# EAGLE design open_bioband_VA.3final (EAGLE 8.0.0)
COMPANY: ADAFRUIT INDUSTRIES; DRAWN: KTOWN; REV: B
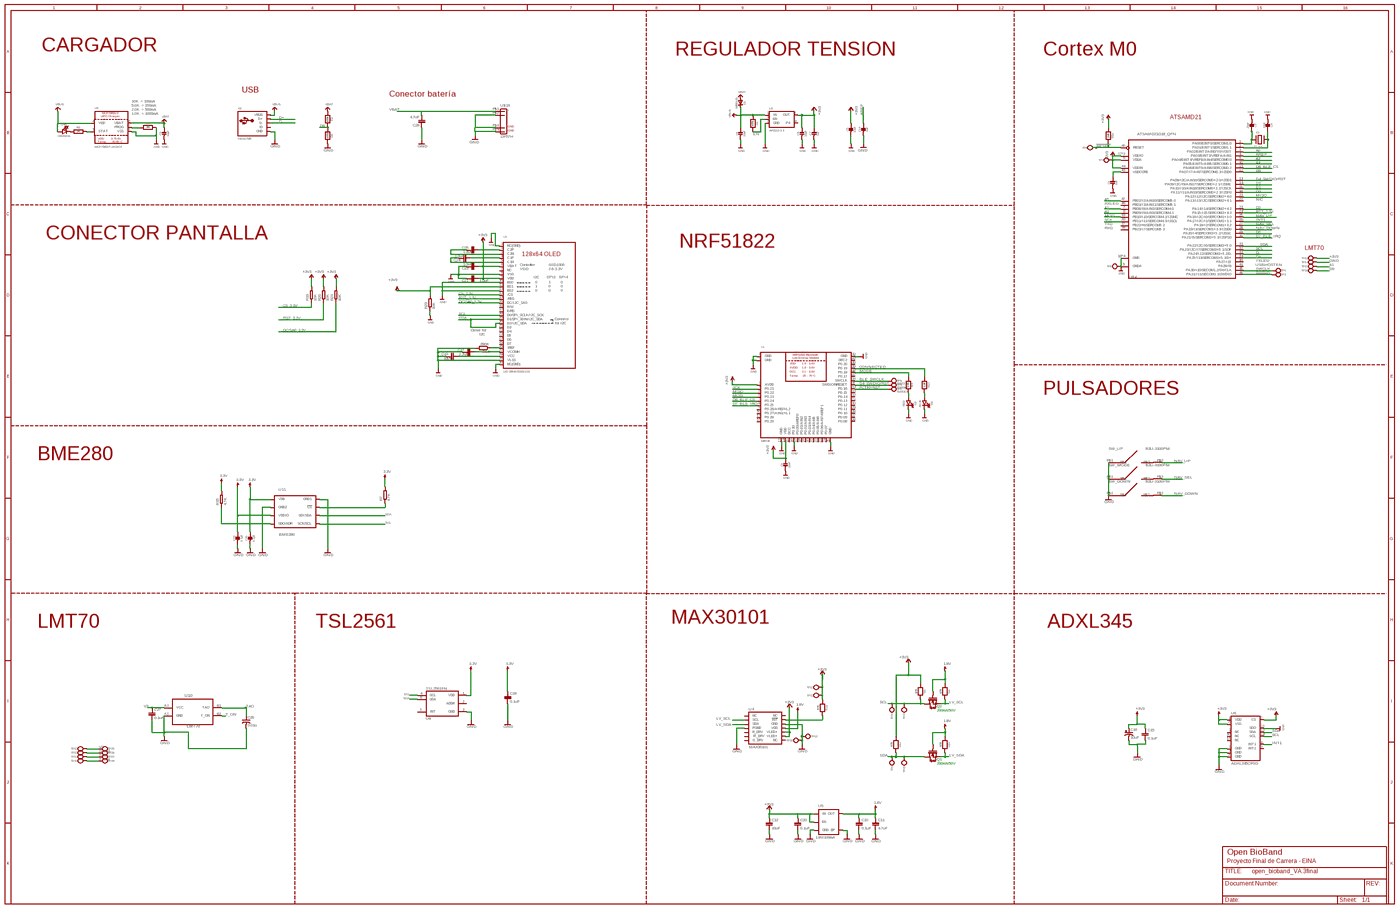
[diagram p0: schematic, sheet 1, overview]
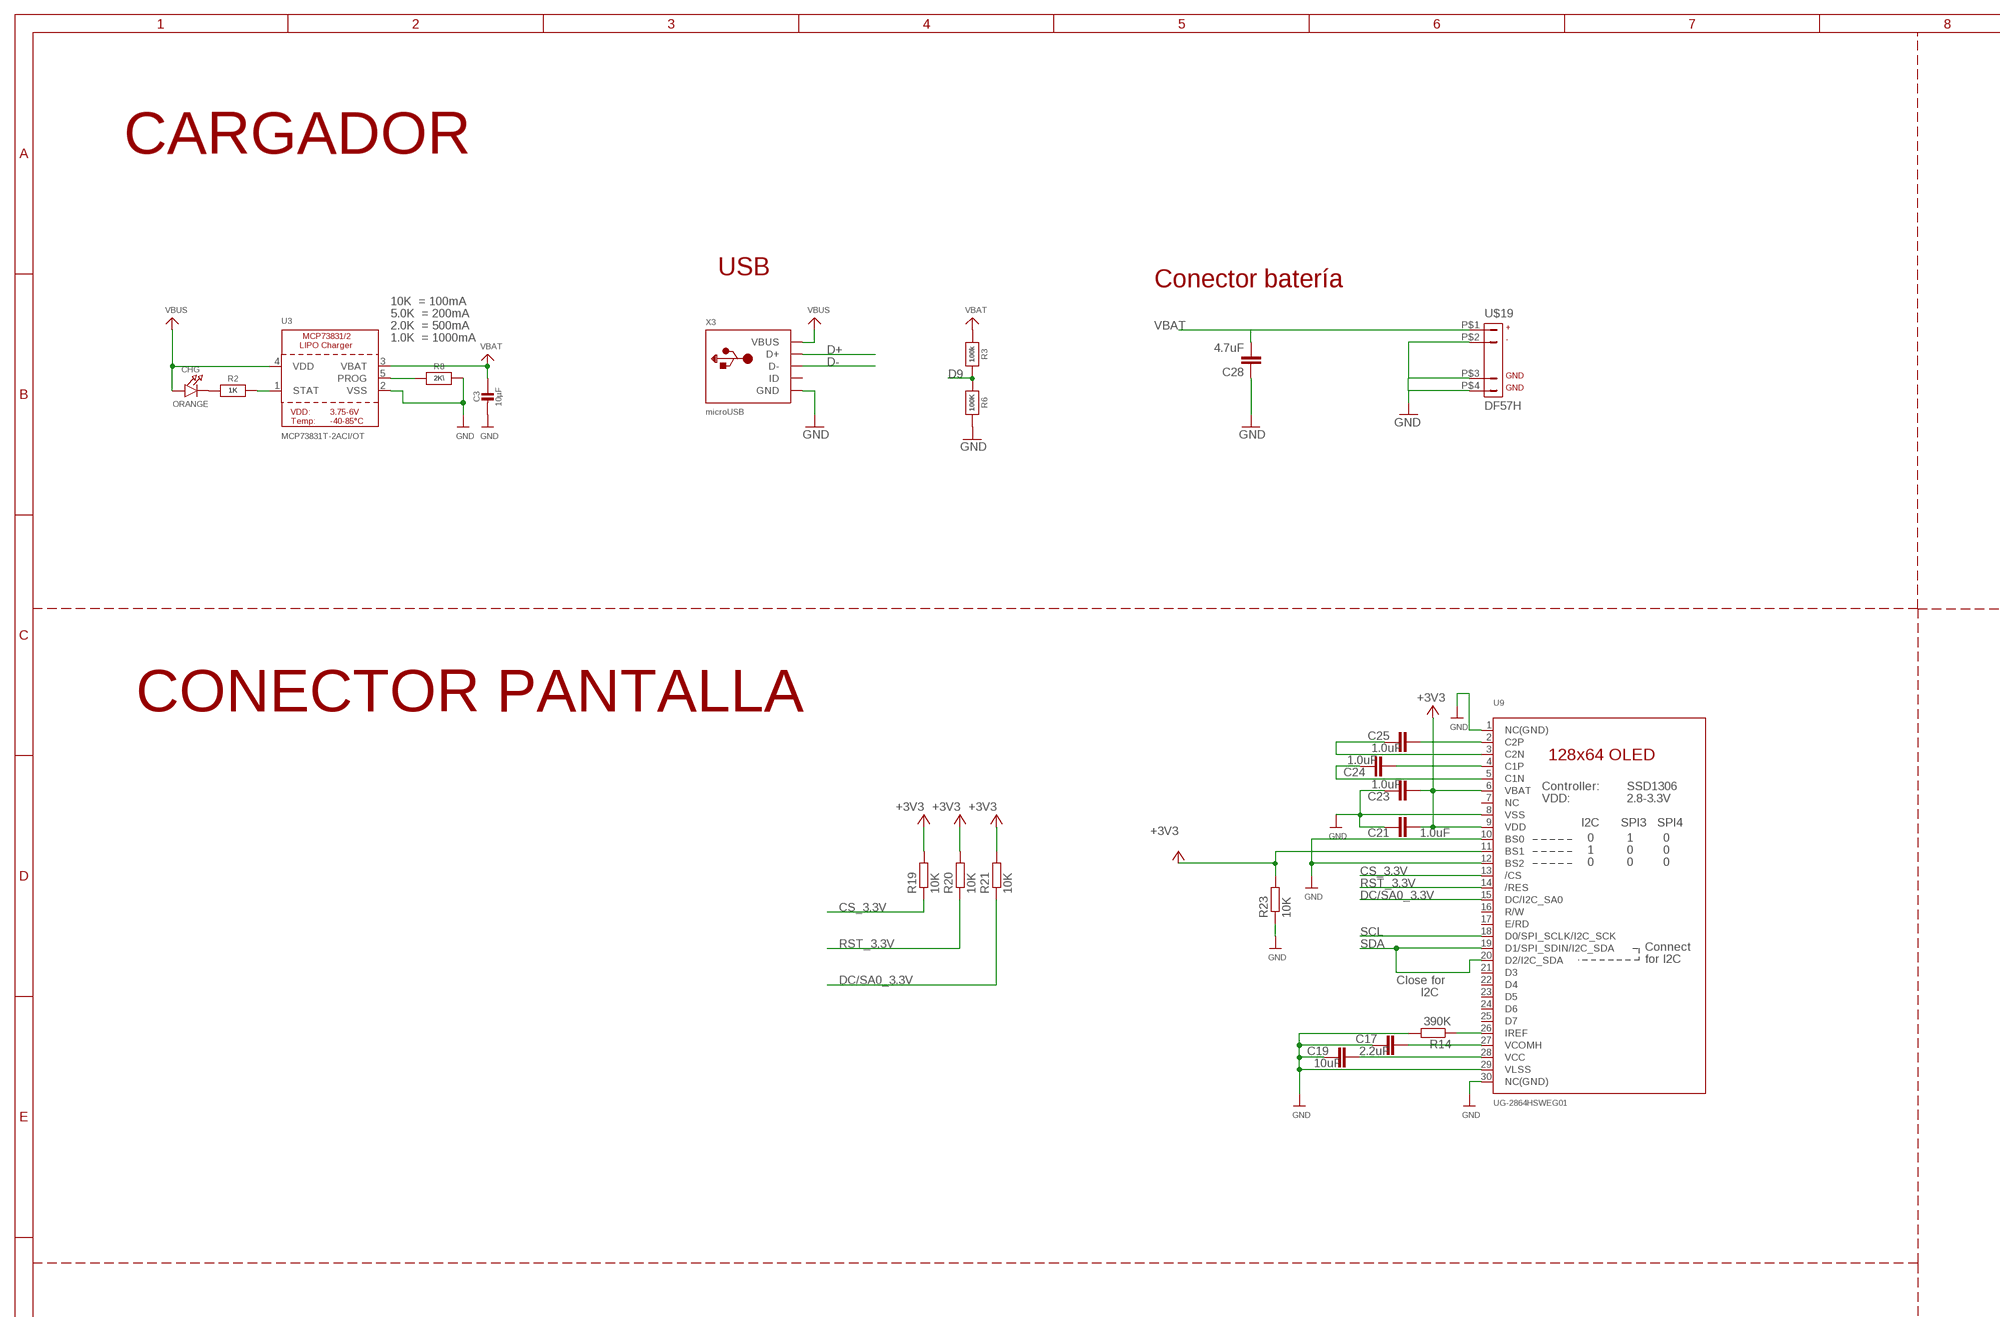
[diagram p1: schematic, sheet 1, part 1 of 4]
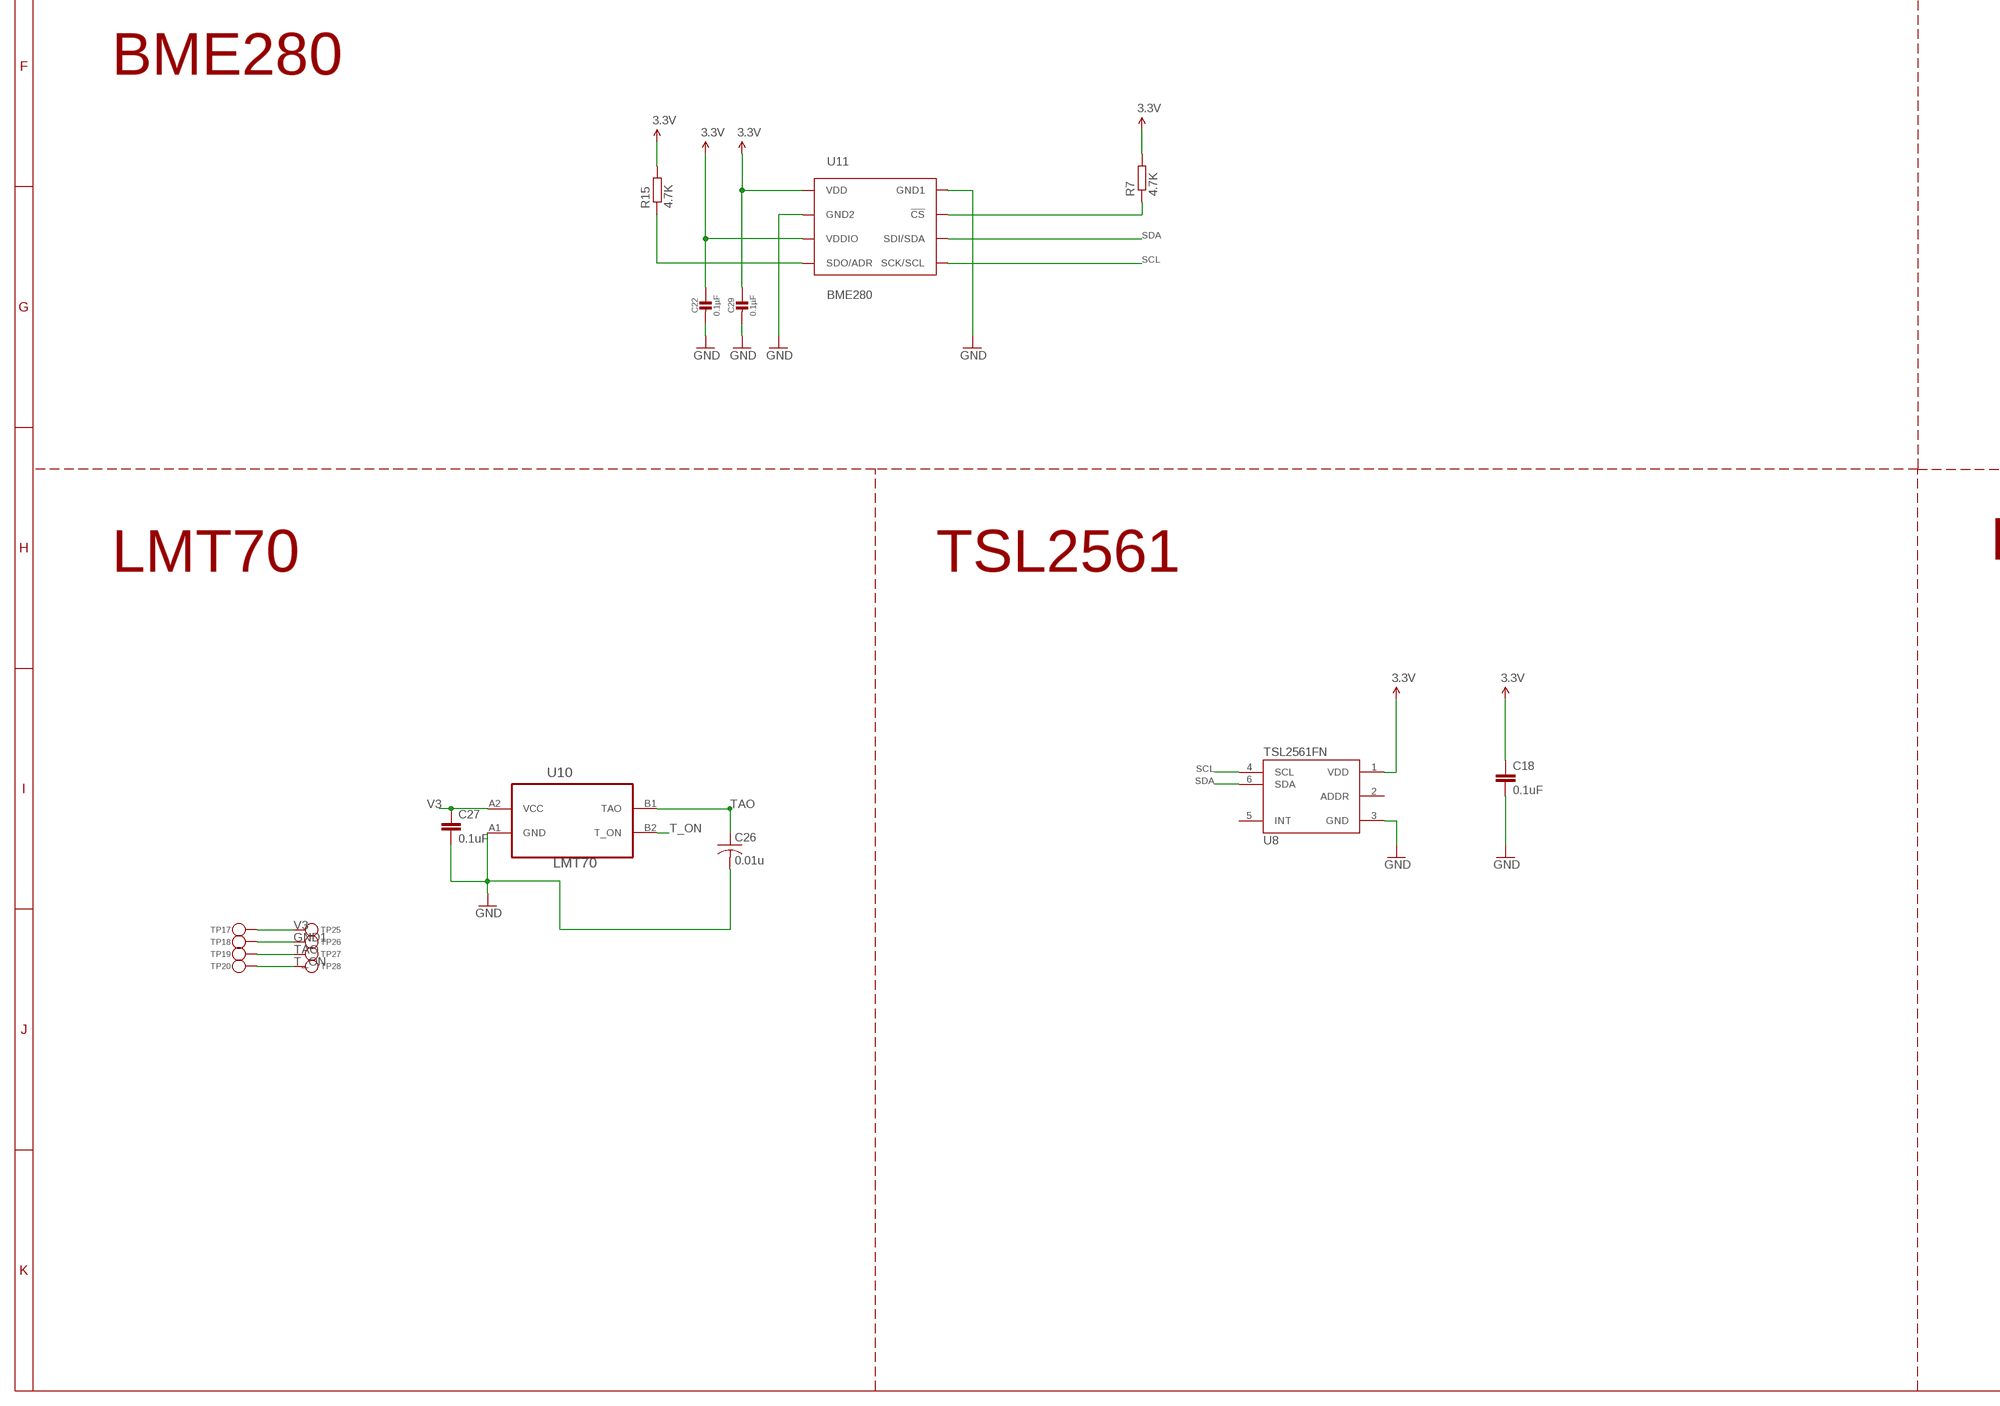
[diagram p2: schematic, sheet 1, part 2 of 4]
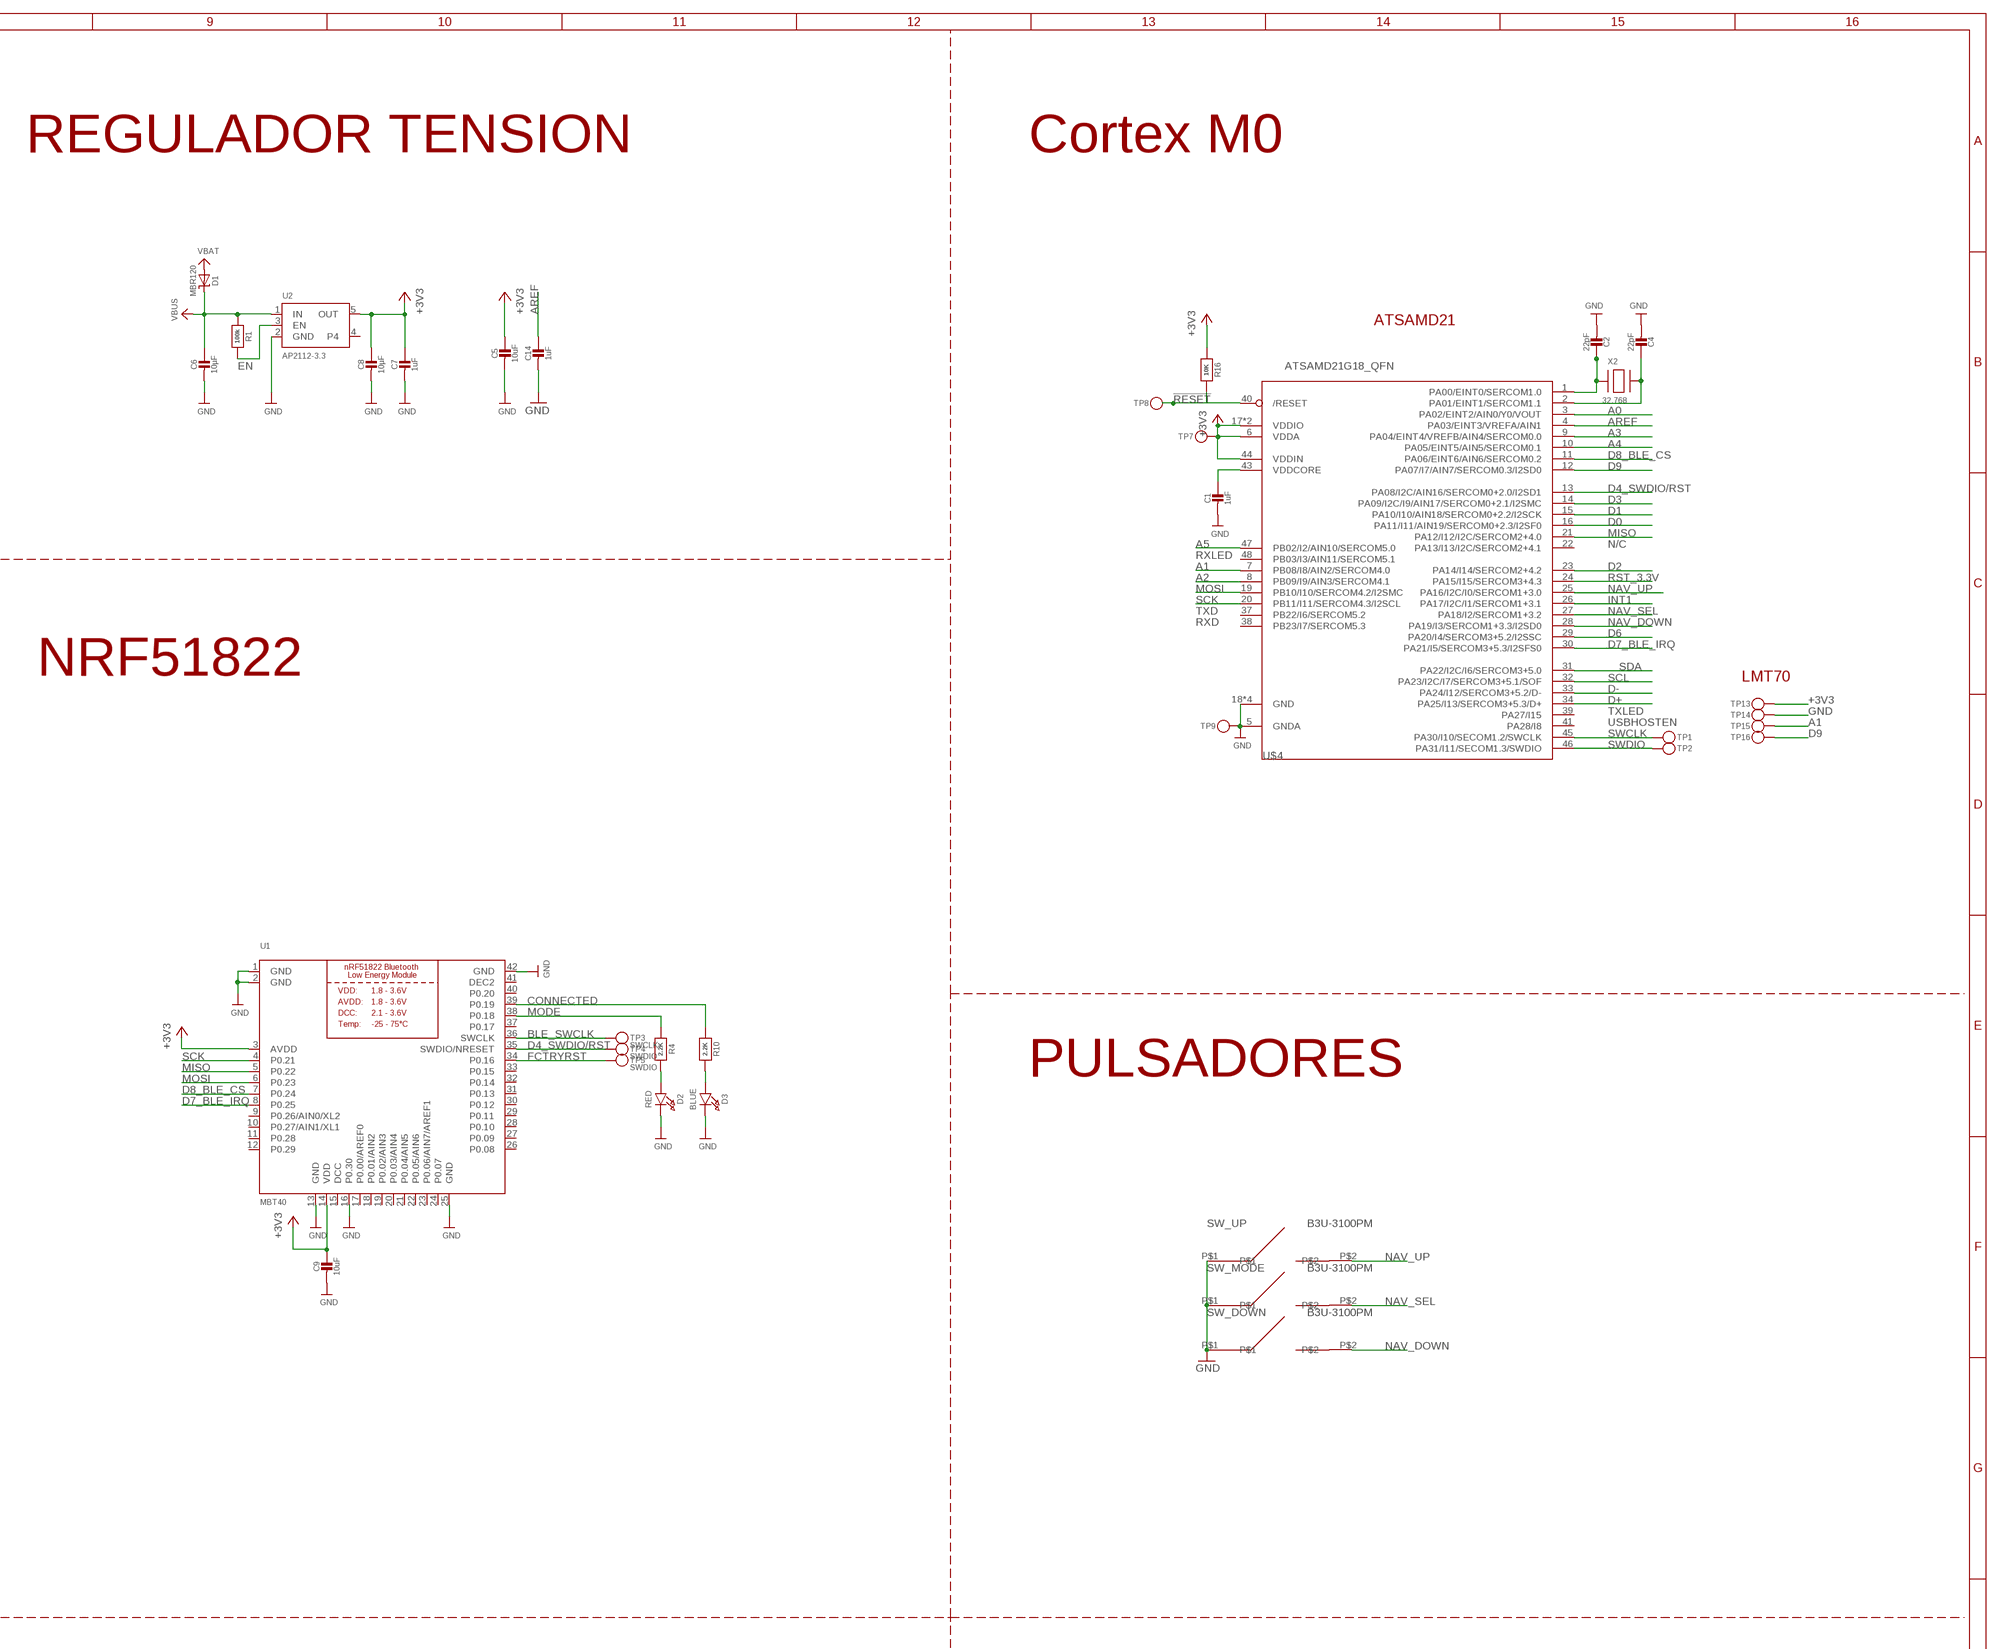
[diagram p3: schematic, sheet 1, part 3 of 4]
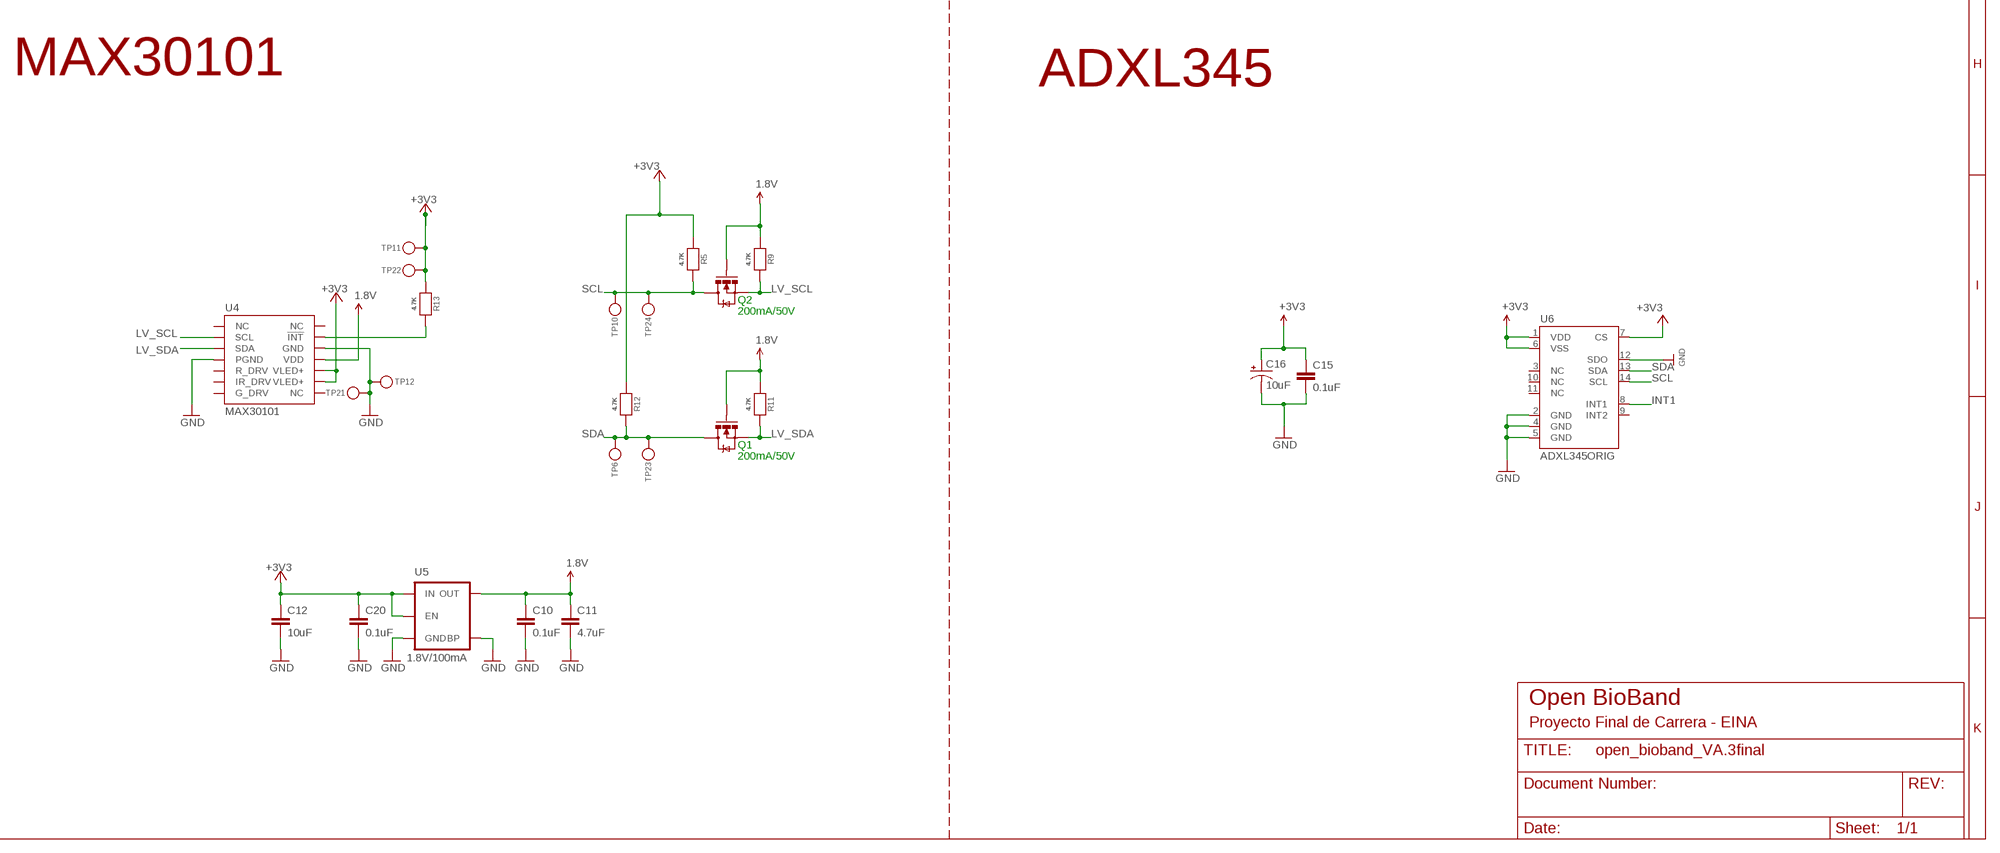
[diagram p4: schematic, sheet 1, part 4 of 4]

## Parts
C1  1uF  CAP_CERAMIC_0402  [_0402]
C2  22pF  CAP_CERAMIC_0402  [_0402]
C3  10µF  CAP_CERAMIC_0402  [_0402]
C4  22pF  CAP_CERAMIC_0402  [_0402]
C5  10uF  CAP_CERAMIC_0402  [_0402]
C6  10µF  CAP_CERAMIC_0402  [_0402]
C7  1uF  CAP_CERAMIC_0402  [_0402]
C8  10µF  CAP_CERAMIC_0402  [_0402]
C9  10uF  CAP_CERAMIC_0402  [_0402]
C10  0.1uF  CAP0402-CAP  [0402-CAP]
C11  4.7uF  CAP0402-CAP  [0402-CAP]
C12  10uF  CAP0402-CAP  [0402-CAP]
C14  1uF  CAP_CERAMIC_0402  [_0402]
C15  0.1uF  CAP0402-CAP  [0402-CAP]
C16  10uF  CAP_POL1206  [EIA3216]
C17  2.2uF  1.0UF-0402-16V-10%  [0402]
C18  0.1uF  CAP0402-CAP  [0402-CAP]
C19  10uF  1.0UF-0402-16V-10%  [0402]
C20  0.1uF  CAP0402-CAP  [0402-CAP]
C21  1.0uF  1.0UF-0402-16V-10%  [0402]
C22  0.1µF  CAP_CERAMIC_0402  [_0402]
C23  1.0uF  1.0UF-0402-16V-10%  [0402]
C24  1.0uF  1.0UF-0402-16V-10%  [0402]
C25  1.0uF  1.0UF-0402-16V-10%  [0402]
C26  0.01u  C-USC0402  [C0402]
C27  0.1uF  0.1UF-0402-16V-10%  [0402]
C28  4.7uF  C-EUC0402  [C0402]
C29  0.1µF  CAP_CERAMIC_0402  [_0402]
CHG  ORANGE  LED0603  [CHIPLED_0603]
D1  MBR120  DIODE-SCHOTTKYSOD-123  [SOD-123@1]
D2  RED  LED0603  [CHIPLED_0603]
D3  BLUE  LED0603  [CHIPLED_0603]
Q1  200mA/50V  MOSFET-NCHANNELBSS138  [SOT23-3]
Q2  200mA/50V  MOSFET-NCHANNELBSS138  [SOT23-3]
R1  100k  RESISTOR_0402  [_0402]
R2  1K  RESISTOR_0402  [_0402]
R3  100k  RESISTOR_0402  [_0402]
R4  2.2K  RESISTOR_0402  [_0402]
R5  4.7K  RESISTOR_0402  [_0402]
R6  100K  RESISTOR_0402  [_0402]
R7  4.7K  RR0402  [R0402]
R8  2K\  RESISTOR_0402  [_0402]
R9  4.7K  RESISTOR_0402  [_0402]
R10  2.2K  RESISTOR_0402  [_0402]
R11  4.7K  RESISTOR_0402  [_0402]
R12  4.7K  RESISTOR_0402  [_0402]
R13  4.7K  RESISTOR_0402  [_0402]
R14  390K  RR0402  [R0402]
R15  4.7K  RR0402  [R0402]
R16  10K  RESISTOR_0402  [_0402]
R19  10K  RR0402  [R0402]
R20  10K  RR0402  [R0402]
R21  10K  RR0402  [R0402]
R23  10K  RR0402  [R0402]
SW_DOWN  B3U-3100PM  [B3U-3100PM]
SW_MODE  B3U-3100PM  [B3U-3100PM]
SW_UP  B3U-3100PM  [B3U-3100PM]
TP1  TESTPOINTROUND1MM  [TESTPOINT_ROUND_1MM]
TP2  TESTPOINTROUND1MM  [TESTPOINT_ROUND_1MM]
TP3  SWCLK  TESTPOINTPAD1MM  [TESTPOINT_PAD_1MM]
TP4  SWDIO  TESTPOINTPAD1MM  [TESTPOINT_PAD_1MM]
TP5  SWDIO  TESTPOINTPAD1MM  [TESTPOINT_PAD_1MM]
TP6  TESTPOINTROUND0.5MM  [TESTPOINT_ROUND_0.5MM]
TP7  TESTPOINTROUND1MM  [TESTPOINT_ROUND_1MM]
TP8  TESTPOINTROUND1MM  [TESTPOINT_ROUND_1MM]
TP9  TESTPOINTROUND1MM  [TESTPOINT_ROUND_1MM]
TP10  TESTPOINTROUND0.5MM  [TESTPOINT_ROUND_0.5MM]
TP11  TESTPOINTROUND0.5MM  [TESTPOINT_ROUND_0.5MM]
TP12  TESTPOINTROUND0.5MM  [TESTPOINT_ROUND_0.5MM]
TP13  TESTPOINTROUND1MM  [TESTPOINT_ROUND_1MM]
TP14  TESTPOINTROUND1MM  [TESTPOINT_ROUND_1MM]
TP15  TESTPOINTROUND1MM  [TESTPOINT_ROUND_1MM]
TP16  TESTPOINTROUND1MM  [TESTPOINT_ROUND_1MM]
TP17  TESTPOINT0.1"  [1X01_ROUND]
TP18  TESTPOINT0.1"  [1X01_ROUND]
TP19  TESTPOINT0.1"  [1X01_ROUND]
TP20  TESTPOINT0.1"  [1X01_ROUND]
TP21  TESTPOINT0.1"  [1X01_ROUND]
TP22  TESTPOINT0.1"  [1X01_ROUND]
TP23  TESTPOINT0.1"  [1X01_ROUND]
TP24  TESTPOINT0.1"  [1X01_ROUND]
TP25  TESTPOINTPAD2MM  [TESTPOINT_PAD_2MM]
TP26  TESTPOINTPAD2MM  [TESTPOINT_PAD_2MM]
TP27  TESTPOINTPAD2MM  [TESTPOINT_PAD_2MM]
TP28  TESTPOINTPAD2MM  [TESTPOINT_PAD_2MM]
U1  MBT40  NRF51822_MODULE_MDBT40  [BLE_MODULE_RAYTAC_MDBT40]
U2  AP2112-3.3  VREG_SOT23-5  [SOT23-5]
U3  MCP73831T-2ACI/OT  MCP73831/2  [SOT23-5@1]
U4  MAX30101  MAX30105SMD  [OLGA-14]
U5  1.8V/100mA  V_REG_SP62141.8V  [SC70]
U6  ADXL345ORIG  [LGA14]
U8  TSL2561FN  [FN-6]
U9  UG-2864HSWEG01  DISP_OLED_UG-2864HSWEG010.96"  [UG-2864HSWEG01_0.96IN_WRAPAROUND]
U10  LMT70LMT70  [BGA4C40P2X2_77X77X50]
U11  BME280  [BME280_LGA]
U$4  ATSAMD21G18_QFN  ATSAMD21J_QFN  [TQFN48_7MM]
U$19  DF57H  [DF57H-2P]
X2  32.768  XTAL-3.2X1.5  [XTAL3215]
X3  microUSB  USB_MICRO_20329_V2  [4UCONN_20329_V2]

## Nets
1.8V: C10.1 C11.1 Q1.1(G) Q2.1(G) R9.1 R11.1 U4.11(VDD) U5.5(OUT)
!CS1: R7.1 U11.P$2(!CS)
!INT: R13.2 U4.13(!INT)
!RESET: R16.2 TP8.P$1 U$4.40(/RESET)
+3V3: C5.1 C7.1 C8.1 C9.1 C12.1 C15.1 C16.A(+) C18.1 C20.1 C21.2 C22.1 C23.2 C29.1 R5.1 R7.2 R12.1 R13.1 R15.2 R16.1 R19.2 R20.2 R21.2 R23.2 TP7.P$1 TP11.P$1 TP13.P$1 TP22.1 U1.3(AVDD) U1.14(VDD) U2.5(OUT) U4.9(VLED+) U4.10(VLED+) U5.1(IN) U5.3(EN) U6.1(VDD) U6.6(VSS) U6.7(CS) U8.1(VDD) U9.6(VBAT) U9.9(VDD) U9.11(BS1) U11.P$6(VDDIO) U11.P$8(VDD) U$4.6(VDDA) U$4.17(VDDIO) U$4.36(VDDIO) U$4.44(VDDIN) ; supply symbol labelled 3.3V
A0: U$4.3(PA02/EINT2/AIN0/Y0/VOUT)
A1: TP15.P$1 U$4.7(PB08/I8/AIN2/SERCOM4.0)
A2: U$4.8(PB09/I9/AIN3/SERCOM4.1)
A3: U$4.9(PA04/EINT4/VREFB/AIN4/SERCOM0.0)
A4: U$4.10(PA05/EINT5/AIN5/SERCOM0.1)
A5: U$4.47(PB02/I2/AIN10/SERCOM5.0)
AREF: C14.1 U$4.4(PA03/EINT3/VREFA/AIN1)
BLE_SWCLK: TP3.P$1 U1.36(SWCLK)
CONNECTED: R10.1 U1.39(P0.19)
CS_3.3V: R19.1 U9.13(/CS)
D0: U$4.16(PA11/I11/AIN19/SERCOM0+2.3/I2SF0)
D1: U$4.15(PA10/I10/AIN18/SERCOM0+2.2/I2SCK)
D2: U$4.23(PA14/I14/SERCOM2+4.2)
D3: U$4.14(PA09/I2C/I9/AIN17/SERCOM0+2.1/I2SMC)
D4_SWDIO/RST: TP4.P$1 U1.35(SWDIO/NRESET) U$4.13(PA08/I2C/AIN16/SERCOM0+2.0/I2SD1)
D6: U$4.29(PA20/I4/SERCOM3+5.2/I2SSC)
D7_BLE_IRQ: U1.8(P0.25) U$4.30(PA21/I5/SERCOM3+5.3/I2SFS0)
D8_BLE_CS: U1.7(P0.24) U$4.11(PA06/EINT6/AIN6/SERCOM0.2)
D9: R3.2 R6.1 TP16.P$1 U$4.12(PA07/I7/AIN7/SERCOM0.3/I2SD0)
D+: U$4.34(PA25/I13/SERCOM3+5.3/D+) X3.D+
D-: U$4.33(PA24/I12/SERCOM3+5.2/D-) X3.D-
DC/SA0_3.3V: R21.1 U9.15(DC/I2C_SA0)
EN: R1.2 U2.3(EN)
FCTRYRST: TP5.P$1 U1.34(P0.16)
GND: C1.2 C2.2 C3.2 C4.2 C5.2 C6.2 C7.2 C8.2 C9.2 C10.2 C11.2 C12.2 C14.2 C15.2 C16.C(-) C17.1 C18.2 C19.1 C20.2 C21.1 C22.2 C23.1 C28.1 C29.2 D2.C D3.C R6.2 R8.2 R14.2 R23.1 SW_DOWN.P$1 SW_MODE.P$1 SW_UP.P$1 TP9.P$1 TP12.P$1 TP14.P$1 TP21.1 U1.1(GND) U1.2(GND) U1.13(GND) U1.16(P0.30) U1.25(GND) U1.42(GND) U2.2(GND) U3.2(VSS) U4.4(PGND) U4.12(GND) U5.2(GND) U5.4(BP) U6.2(GND) U6.4(GND) U6.5(GND) U6.12(SDO) U8.3(GND) U9.1(NC(GND)) U9.8(VSS) U9.10(BS0) U9.12(BS2) U9.29(VLSS) U9.30(NC(GND)) U11.P$1(GND1) U11.P$7(GND2) U$4.5(GNDA) U$4.18(GND) U$4.35(GND) U$4.42(GND) U$4.THERMAL(GND) U$19.P$2 U$19.P$3 U$19.P$4 X3.BASE@1(GND) X3.BASE@2(GND) X3.GND X3.SPRT@1(GND) X3.SPRT@2(GND) X3.SPRT@3(GND) X3.SPRT@4(GND)
GND1: C26.2 C27.2 TP18.1 TP26.P$1 U10.A1(GND) ; supply symbol labelled GND
INT1: U6.8(INT1) U$4.26(PA17/I2C/I1/SERCOM1+3.1)
LV_SCL: Q2.2(S) R9.2 U4.2(SCL)
LV_SDA: Q1.2(S) R11.2 U4.3(SDA)
MISO: U1.5(P0.22) U$4.21(PA12/I12/I2C/SERCOM2+4.0)
MODE: R4.1 U1.38(P0.18)
MOSI: U1.6(P0.23) U$4.19(PB10/I10/SERCOM4.2/I2SMC)
N$1: CHG.C R2.1
N$3: R2.2 U3.1(STAT)
N$4: R8.1 U3.5(PROG)
N$5: C2.1 U$4.1(PA00/EINT0/SERCOM1.0) X2.P$1
N$6: D2.A R4.2
N$7: C4.1 U$4.2(PA01/EINT1/SERCOM1.1) X2.P$2
N$8: D3.A R10.2
N$11: R14.1 U9.26(IREF)
N$12: C25.2 U9.2(C2P)
N$13: C25.1 U9.3(C2N)
N$14: C24.2 U9.4(C1P)
N$15: C24.1 U9.5(C1N)
N$16: C19.2 U9.28(VCC)
N$17: C17.2 U9.27(VCOMH)
NAV_DOWN: SW_DOWN.P$2 U$4.28(PA19/I3/SERCOM1+3.3/I2SD0)
NAV_SEL: SW_MODE.P$2 U$4.27(PA18/I2/SERCOM1+3.2)
NAV_UP: SW_UP.P$2 U$4.25(PA16/I2C/I0/SERCOM1+3.0)
RST_3.3V: R20.1 U9.14(/RES) U$4.24(PA15/I15/SERCOM3+4.3)
SCK: U1.4(P0.21) U$4.20(PB11/I11/SERCOM4.3/I2SCL)
SCL: Q2.3(D) R5.2 TP10.P$1 TP24.1 U6.14(SCL) U8.4(SCL) U9.18(D0/SPI_SCLK/I2C_SCK) U11.P$4(SCK/SCL) U$4.32(PA23/I2C/I7/SERCOM3+5.1/SOF)
SDA: Q1.3(D) R12.2 TP6.P$1 TP23.1 U6.13(SDA) U8.6(SDA) U9.19(D1/SPI_SDIN/I2C_SDA) U9.20(D2/I2C_SDA) U11.P$3(SDI/SDA) U$4.31(PA22/I2C/I6/SERCOM3+5.0)
SDO/ADR1: R15.1 U11.P$5(SDO/ADR)
SWCLK: TP1.P$1 U$4.45(PA30/I10/SECOM1.2/SWCLK)
SWDIO: TP2.P$1 U$4.46(PA31/I11/SECOM1.3/SWDIO)
T_ON: TP20.1 TP28.P$1 U10.B2(T_ON)
TAO: C26.1 TP19.1 TP27.P$1 U10.B1(TAO)
V3: C27.1 TP17.1 TP25.P$1 U10.A2(VCC)
VBAT: C3.1 C28.2 D1.A R3.1 U3.3(VBAT) U$19.P$1
VBUS: C6.1 CHG.A D1.C R1.1 U2.1(IN) U3.4(VDD) X3.VBUS
VDDCORE: C1.1 U$4.43(VDDCORE)
Unconnected: U1.9(P0.26/AIN0/XL2) U1.10(P0.27/AIN1/XL1) U1.11(P0.28) U1.12(P0.29) U1.17(P0.00/AREF0) U1.18(P0.01/AIN2) U1.19(P0.02/AIN3) U1.20(P0.03/AIN4) U1.21(P0.04/AIN5) U1.22(P0.05/AIN6) U1.23(P0.06/AIN7/AREF1) U1.24(P0.07) U1.26(P0.08) U1.27(P0.09) U1.28(P0.10) U1.29(P0.11) U1.30(P0.12) U1.31(P0.13) U1.32(P0.14) U1.33(P0.15) U1.37(P0.17) U1.40(P0.20) U2.4 U4.1(NC) U4.5(R_DRV) U4.6(IR_DRV) U4.7(G_DRV) U4.8(NC) U4.14(NC) U6.3(NC) U6.9(INT2) U6.10(NC) U6.11(NC) U8.2(ADDR) U8.5(INT) U9.7(NC) U9.16(R/W) U9.17(E/RD) U9.21(D3) U9.22(D4) U9.23(D5) U9.24(D6) U9.25(D7) U$4.22(PA13/I13/I2C/SERCOM2+4.1) U$4.37(PB22/I6/SERCOM5.2) U$4.38(PB23/I7/SERCOM5.3) U$4.39(PA27/I15) U$4.41(PA28/I8) U$4.48(PB03/I3/AIN11/SERCOM5.1) X3.ID

## Notes on the sheet
- CARGADOR | REGULADOR TENSION | Cortex M0
- USB
- Conector batería
- 10K  = 100mA
- 5.0K  = 200mA
- 2.0K  = 500mA
- 1.0K  = 1000mA
- ATSAMD21
- N/C
- RXLED
- CONECTOR PANTALLA | TXD
- RXD
- NRF51822
- LMT70
- TXLED
- USBHOSTEN
- Close for
- I2C
- PULSADORES
- BME280
- LMT70 | TSL2561 | MAX30101 | ADXL345
- Open BioBand
- Proyecto Final de Carrera - EINA

## Power pins joined to a net without a drawn wire
DCC: U1.15(DCC)
DEC2: U1.41(DEC2)

## Library data of the parts
C1-C9 C14 C22 C29 = microbuilder:CAP_CERAMIC: Ceramic Capacitors For new designs, use the packages preceded by an '_' character since they are more reliable: The following footprints should be used on most boards: _0402 - Standard footprint for regular board layouts _0603 - Standard footprint for regular board layouts _0805 - Standard footprint for regular board layouts _1206 - Standard footprint for regular board layouts For extremely tight-pitch boards where space is at a premium, the following 'micro-pitch' footprints can be used (smaller pads, no silkscreen outline, etc.): _0402MP - Micro-pitch footprint for very dense/compact boards _0603MP - Micro-pitch footprint for very dense/compact boards _0805MP - Micro-pitch footprint for very dense/compact boards _1206MP - Micro-pitch footprint for very dense/compact boards
C10-C12 C18 C20 = SparkFun-Capacitors:CAP: Capacitor Standard 0603 ceramic capacitor, and 0.1" leaded capacitor.
C15 = SparkFun:CAP: Capacitor Standard 0603 ceramic capacitor, and 0.1" leaded capacitor.
C16 = SparkFun:CAP_POL: Capacitor Polarized These are standard SMD and PTH capacitors. Normally 10uF, 47uF, and 100uF in electrolytic and tantalum varieties. Always verify the external diameter of the through hole cap, it varies with capacity, voltage, and manufacturer. The EIA devices should be standard.
C17 C19 = SparkFun-Capacitors:1.0UF: 1µF ceramic capacitors A capacitor is a passive two-terminal electrical component used to store electrical energy temporarily in an electric field.; PROD_ID: CAP-12417; VALUE: 1.0uF
C21 C23-C25 = SparkFun-Capacitors:1.0UF: 1µF ceramic capacitors A capacitor is a passive two-terminal electrical component used to store electrical energy temporarily in an electric field.; PROD_ID: CAP-12417
C26 = adafruit:C-US: CAPACITOR, American symbol
C27 = SparkFun-Capacitors:0.1UF: 0.1µF ceramic capacitors A capacitor is a passive two-terminal electrical component used to store electrical energy temporarily in an electric field.; PROD_ID: CAP-12416
C28 = rcl:C-EU: CAPACITOR, European symbol
CHG D2 D3 = microbuilder:LED: LED 0603 - 0603 Surface Mount Package 2mA: Green LED - Low Power (3.9mcd, 2ma, 1.7Vf) - Digikey: 475-2709-2-ND Orange LED - Low Power (9.8mcd, 2ma, 1.8Vf) - Digikey: 475-1194-2-ND Red LED - Low Power (5mcd, 2ma, 1.8Vf) - Digikey: 475-1195-2-ND Yellow LED - Low Power (7mcd, 2ma, 1.8Vf) - Digikey: 475-1196-2-ND 5mA: Blue LED - Low Power (17mcd, 5ma, 2.9Vf) - Digikey: LNJ937W8CRACT-ND 0805 - 0805 Surface Mount Package 2mA: Red LED (8.8mcd, 2mA, 1.8Vf, Clear) - Low Power [Digikey: 475-2510-1-ND] Green LED (5mcd, 2mA, 1.8Vf, Clear) - Low Power [Digikey: 475-2730-1-ND] Yellow LED (11.3mcd, 2mA, 1.8Vf, Clear) - Low Power [Digikey: 475-2555-1-ND] 20mA: Red LED (104mcd, 20mA, Diffused) - LS R976 [Digikey: 475-1278-6-ND] Red LED (12mcd, 20mA, 2.0Vf, Clear) - APT2012EC [Digikey: 754-1128-1-ND] Green LED (15mcd, 20mA, 2.2Vf, Clear) - APT2012GC [Digikey: 754-1131-1-ND] Orange LED (160mcd, 20mA, 2.1Vf, Clear) - APT2012SECK [Digikey: 754-1130-1-ND] 1206 - 1206 Surface Mount Package Green LED (26mcd, 20mA, Diffused) - LG N971 [Digikey: 475-1407-6-ND] Red LED (15mcd, 20mA, Diffused) - LH N974 [Digikey: 475-1416-6-ND] Cree - Cree High-Power Surface Mount LEDs XPEBWT-L1-0000-00D50 - White 111lm 350mA 2.9Vf 6200K 110° XTEAWT-00-0000-00000LEE3 - White 114lm 350mA 2.85Vf 5000K 115° Everlight - Everlight 45-21 Series Surface Mount LEDs 45-21/QK2C-B2832AC2CB2/2T - Warm White 2000mcd 20mA 3.25Vf 3050K 120° 45-21/LK2C-B38452C4CB2/2T - Nuetral White 2000mcd 20mA 3.25Vf 4150K 120° 45-21/LK2C-B50634C6CB2/2T - Cold White 2200mcd 20mA 3.25Vf 5650K 120° PLCC2 Reverse Mount LS T77K-J1L2-1-0-2-R18-Z - Red 11.25mcd 2mA 1.8Vf 630nm 120° LO T77K-L1M2-24-Z - Orange 19.6mcd 2mA 1.8Vf 606nm 120° LY T77K-K2M1-26-Z - Yellow 15.7mcd 2mA 1.8Vf 587nm 120°
D1 = microbuilder:DIODE-SCHOTTKY
Q1 Q2 = SparkFun-DiscreteSemi:MOSFET-NCHANNEL: Common NMOSFET Parts MFG P/N Store ID Prod ID FDD8780 TRANS-09984 SI7820DN TRANS-11055 FDS6630A IC-08089 2N7002PW TRANS-11151 FQP30N06L COM-10213 TRANS-10060 BSS123LT1G TRANS-08345 BSS138 TRANS-00830 BS170 2N7000; PROD_ID: TRANS-00830
R1-R6 R8-R13 R16 = microbuilder:RESISTOR: Resistors For new designs, use the packages preceded by an '_' character since they are more reliable: The following footprints should be used on most boards: _0402 - Standard footprint for regular board layouts _0603 - Standard footprint for regular board layouts _0805 - Standard footprint for regular board layouts _1206 - Standard footprint for regular board layouts For extremely tight-pitch boards where space is at a premium, the following 'micro-pitch' footprints can be used (smaller pads, no silkscreen outline, etc.): _0402MP - Micro-pitch footprint for very dense/compact boards _0603MP - Micro-pitch footprint for very dense/compact boards _0805MP - Micro-pitch footprint for very dense/compact boards _1206MP - Micro-pitch footprint for very dense/compact boards
R7 R14 R15 R19-R21 R23 = eagle-ltspice:R: RESISTOR, European symbol; SPICEMODEL: NONE; SPICEPREFIX: R
SW_DOWN SW_MODE SW_UP = AWparts:B3U-3100PM
TP1-TP16 TP25-TP28 = microbuilder:TESTPOINT: Test Point Various test points for characterisation and PCB testing TESTPOINT_SMT - Compact Surface Mount Test Point [Digikey: 5016KTR-ND]
TP17-TP24 = microbuilder:TESTPOINT: Test Point Various test points for characterisation and PCB testing TESTPOINT_SMT - Compact Surface Mount Test Point [Digikey: 5016KTR-ND]; BOM: EXCLUDE
U1 = microbuilder:NRF51822_MODULE_MDBT40: nRF51822 Bluetooth Low Energy Module
U2 = microbuilder:VREG_SOT23-5: SOT23-5 Fixed Voltage Regulators To better organise some of the SOT23-5 fixed voltage regulators in this library, this new part was created. Part Current Out V Out V In V Dropout Digikey Part No. ADP121 150mA 3.3V 3.4-5.5V 0.09V @ 150mA ADP121-AUJZ33R7CT-ND ADP121 150mA 3.0V 3.1-5.5V 0.09V @ 150mA ADP121-AUJZ30R7CT-ND ADP122 300mA 3.3V 3.4-5.5V 0.085V @ 300mA ADP122AUJZ-3.3-R7CT-ND ADP1712 300mA 3.3V 3.5-5.5V 0.17V @ 300mA ADP1712AUJZ-3.3-R7TR-ND AP7311 (Low Cost) 150mA 3.3V 3.5-6V 0.15V @ 150mA AP7311-33WG-7DICT-ND LD39015M18R 150mA 1.8V 1.9V-5.5V 0.08V @ 100mA 497-6977-1-ND MCP1824T-3302E/OT 300mA 3.3V 3.5V-6V 0.2V @ 300mA MCP1824T-3302E/OTCT-ND MIC5205-2.5YM5 TR 150mA 2.5V 2.7-16V 0.165V @ 150mA 576-1257-2-ND MIC5205-3.0YM5 TR 150mA 3.0V 3.2V-16V 0.165V @ 150mA 576-1258-2-ND MIC5205-3.3YM5 TR 150mA 3.3V 3.5V-16V 0.165V @ 150mA 576-1259-2-ND TPS780330220 150mA 3.3V+2.2V 3.6-5.5V 250mV Max 296-23332-1-ND TDA3663/N1,135 100mA 3.3V 3.5-45V 0.18V @ 50mA 568-5343-1-ND
U3 = microbuilder:MCP73831/2: MCP73831/2 LIPO Charger VDD: 3.75 - 6V Temp -40 - 85°C Programmable Charge Rate: 15-500mA NOTE: STAT is a tri-state logic output on the MCP73831 and an open-drain output on the MCP73832. SOT23-5 with 4.2V output and tri-state logic on STAT = MCP73831T-2ACI/OT
U4 = SparkFun-Sensors:MAX30105: Description: Particle Detection IC. Primarily used for smoke detection, can be used for Pulse Detection, Pulse Ox, and possible visual particle detection.; PROD_ID: IC-13510; VALUE: MAX30105
U5 = SparkFun-PowerIC:V_REG_SP6214; PROD_ID: VREG-08428
U6 = Testing:ADXL345
U8 = mike-temp:TSL2561: TSL2561 illumination sensor Approximates Human Eye Response Precisely Measures Illuminance Programmable Interrupt Function with User-Defined Upper and Lower Threshold 400 KHz I2C interface Programmable Analog Gain and Integration Time Supporting 1,000,000-to-1 Dynamic Range Automatically Rejects 50/60-Hz Lighting Ripple Low Active Power (0.75 mW Typical) with Power Down Mode RoHS Compliant The TSL2561 is a light-to-digital converter that transform light intensity to a digital signal output via I2C interface. The device combines one broadband photodiode (visible plus infrared) and one infrared-responding photodiode on a single CMOS integrated circuit capable of providing a near-photopic response over an effective 20-bit dynamic range (16-bit resolution). Two integrating ADCs convert the photodiode currents to a digital output that represents the irradiance measured on each channel. This digital output can be input to a microprocessor where illuminance (ambient light level) in lux is derived using an empirical formula to approximate the human eye response. The TSL2561 device supports a traditional level style interrupt that remains asserted until the firmware clears it.
U9 = microbuilder:DISP_OLED_UG-2864HSWEG01: UG-2864HSWEG01 OLED display Both 1.3" and 0.96" models share the same FPC tab footprint, only the screen dimensions vary.
U10 = LMT70:LMT70: LOW-POWER SINGLE INVERTER GATE; MPN: LMT70; OC_FARNELL: -; OC_NEWARK: 50R7866; PACKAGE: BGA-4; SUPPLIER: Texas Instruments
U11 = BME280ComponentLibrary:BME280; PROD_ID: IC-13090
U$4 = microbuilder:ATSAMD21J
U$19 = onomo:DF57H
X2 = adafruit2:XTAL: Low cost SMT crystals, no capacitors included http://www.ladyada.net/library/eagle
X3 = microbuilder:USB: USB Connectors USBMINIB - Surface Mount Female Mini-B USB Connector 4UConnector: 06564

## Net classes
1 power: width 0.203 mm

## Board
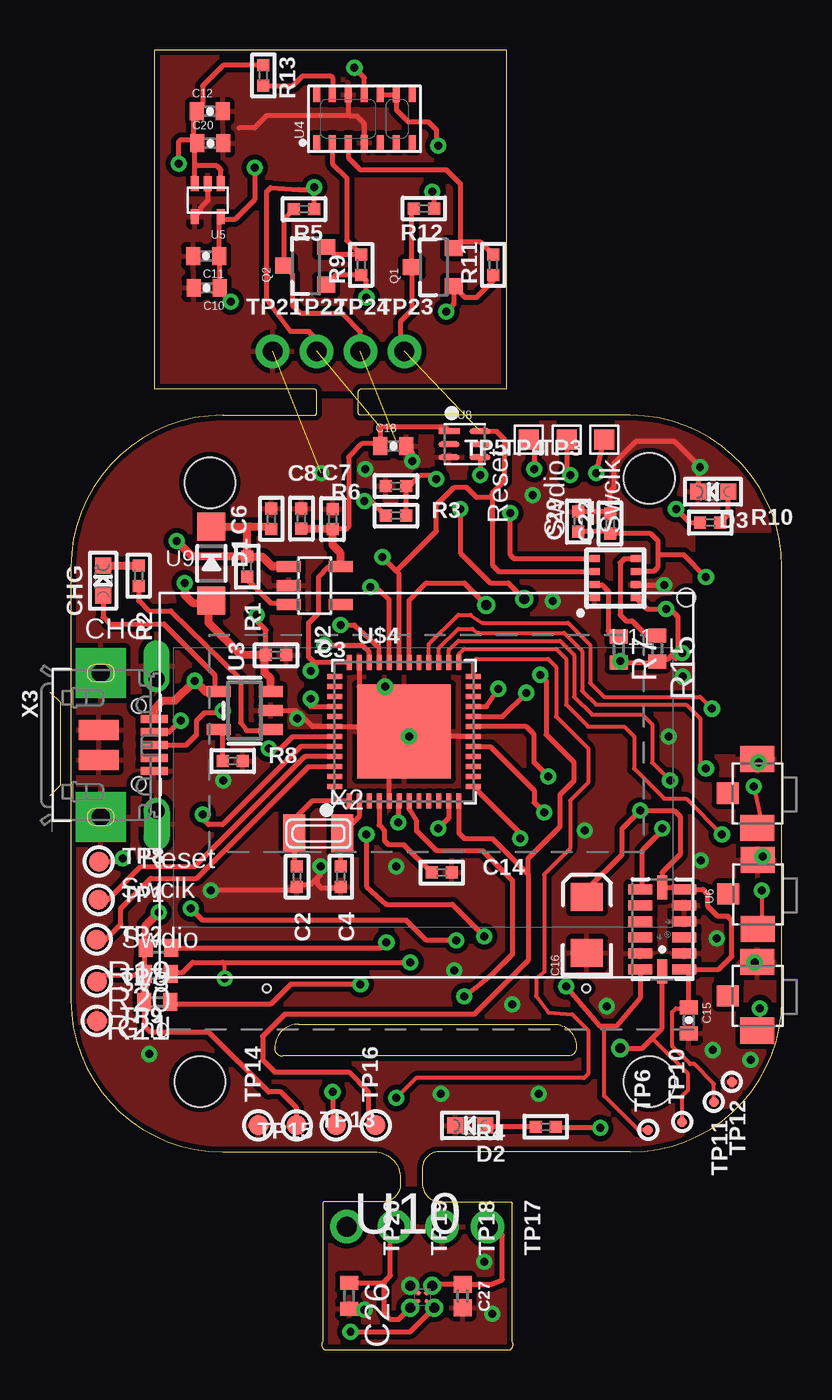
[diagram p5: board, top side]
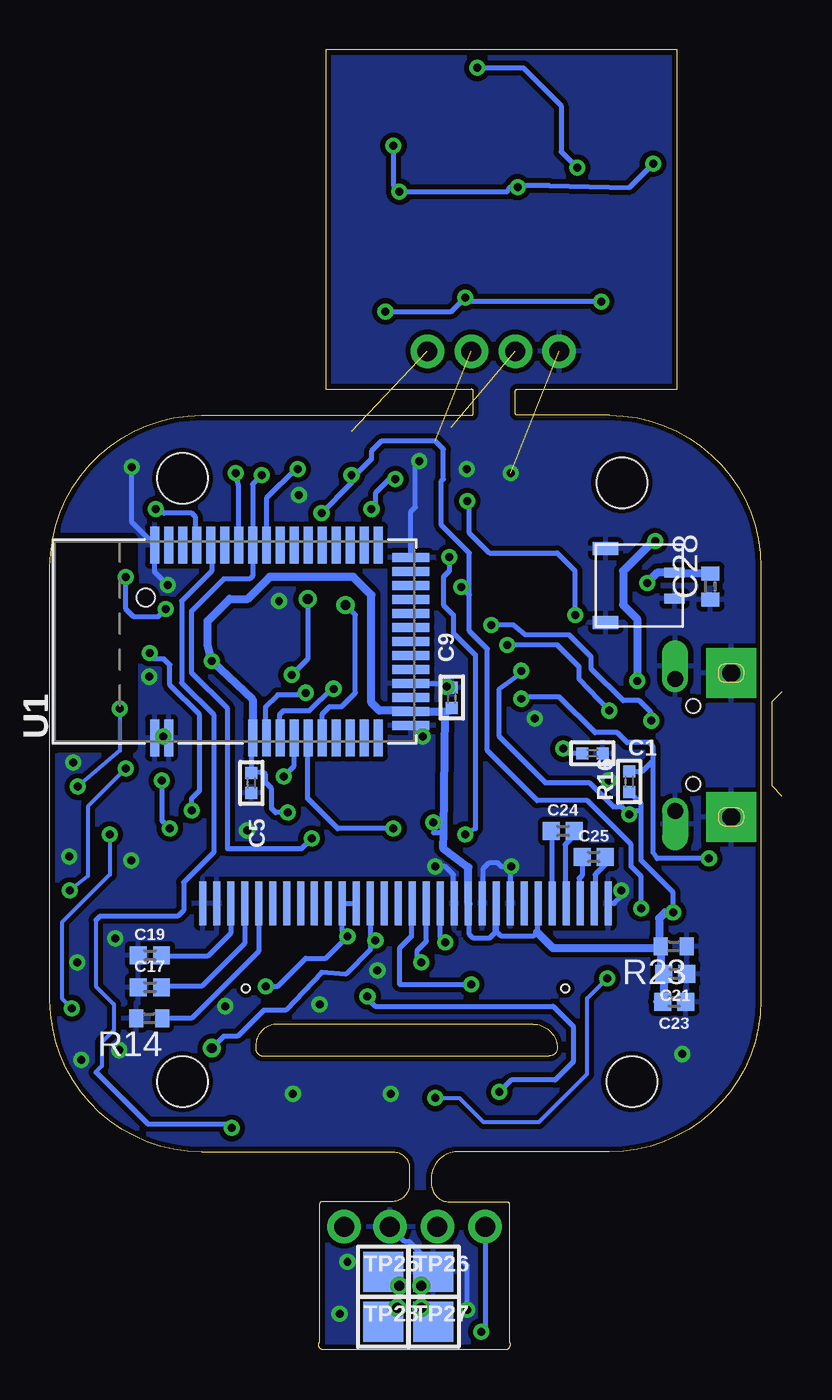
[diagram p6: board, bottom side, seen from below]

Size 36.65 x 65.1 mm. Coordinates in mm from the lower left corner, seen from the top.
Outline: 0,32.95 0.51,32.44 0.51,28.25 0,27.74
Outline: 12.45,16.3 25.25,16.3 arc-90 26.35,15.2 26.35,15.1 arc-90 25.95,14.7 11.65,14.7 arc-90 11.25,15.1 arc-90 12.45,16.3
Outline: 1.05,17.5 arc90 8.65,9.9 16.25,9.9 arc-90 17.55,8.6 17.55,8.3 arc-90 16.65,7.4 13.75,7.4 arc90 13.65,7.3 13.65,0.4 arc90 13.75,0 23.05,0 arc90 23.15,0.4 23.15,7.3 arc90 23.05,7.4 19.55,7.4 arc-90 18.65,8.3 18.65,9.1 arc-90 19.45,9.9 29.05,9.9 arc90 36.65,17.5 36.65,39.2 arc90 29.05,46.8 15.55,46.8 arc-90 15.45,46.9 15.45,48 arc-90 15.55,48.1 22.85,48.1 22.85,65.1 5.25,65.1 5.25,48.1 13.25,48.1 arc-90 13.35,48 13.35,46.9 arc-90 13.25,46.8 8.65,46.8 arc90 1.05,39.2 1.05,17.5
Copper layers (1*16): Top 0.035mm / dielectric 1.5mm / Bottom 0.035mm
Design rules "micron20 *": minimum track width 6mil, minimum drill 6mil, track to track 0.2mm, track to pad 0.2mm, pad to pad 0.2mm, via to via 0.2mm, smd to smd 0mil, copper to edge 8mil, drill to drill 8mil, minimum pad ring 10mil, minimum via ring 8mil, stop-mask expansion 4mil, vias tented up to drill 0mil, thermal gap 10mil
Holes 2.54 mm at 8.01,43.42 30.01,43.64 7.51,13.42 30.01,13.42
tRestrict: area 32.6,30.1 to 36.4,40.6
bRestrict: area 32.5,30.1 to 36.3,40.7

### Footprints (pad centres in the part's own frame; a part is rotated, then mirrored left to right if it is on the bottom)
_0402 = smd 0.6 x 0.6: 1 -0.508,0; 2 0.508,0
0402-CAP = smd 0.7 x 0.9: 1 -0.65,0; 2 0.65,0
EIA3216 = smd 1.4 x 1.6: A 1.4,0; C -1.4,0
0402 = smd 0.85 x 0.9: 1 -0.58,0; 2 0.58,0
C0402 = smd 0.7 x 0.9: 1 -0.65,0; 2 0.65,0
CHIPLED_0603 = smd 0.8 x 0.8: A 0,-0.75; C 0,0.75
SOD-123@1 = smd 1.4 x 1.4: A 1.85,0; C -1.85,0
SOT23-3 = smd 0.8 x 0.9: 1 -0.95,-1; 2 0.95,-1; 3 0,1.1
R0402 = smd 0.7 x 0.9: 1 -0.65,0; 2 0.65,0
B3U-3100PM = smd 1.308 x 1.7: P$1 -1.72,0.84; P$2 1.73,0.84 | smd 1.054 x 1.1: P$3 -0.01,-0.64
TESTPOINT_ROUND_1MM = smd 1 x 1: P$1 0,0
TESTPOINT_PAD_1MM = smd 1 x 1: P$1 0,0
TESTPOINT_ROUND_0.5MM = smd 0.5 x 0.5: P$1 0,0
1X01_ROUND = drill 1 pad 1.676: 1 0,0
TESTPOINT_PAD_2MM = smd 2 x 2: P$1 0,0
BLE_MODULE_RAYTAC_MDBT40 = smd 1.85 x 0.45: 1 -4.825,4; 2 -4.825,3.3; 3 -4.825,-0.9; 4 -4.825,-1.6; 5 -4.825,-2.3; 6 -4.825,-3; 7 -4.825,-3.7; 8 -4.825,-4.4; 9 -4.825,-5.1; 10 -4.825,-5.8; 11 -4.825,-6.5; 12 -4.825,-7.2; 26 4.825,-7.2; 27 4.825,-6.5; 28 4.825,-5.8; 29 4.825,-5.1; 30 4.825,-4.4; 31 4.825,-3.7; 32 4.825,-3; 33 4.825,-2.3; 34 4.825,-1.6; 35 4.825,-0.9; 36 4.825,-0.2; 37 4.825,0.5; 38 4.825,1.2; 39 4.825,1.9; 40 4.825,2.6; 41 4.825,3.3; 42 4.825,4 | smd 0.45 x 1.85: 13 -4.2,-8.825; 14 -3.5,-8.825; 15 -2.8,-8.825; 16 -2.1,-8.825; 17 -1.4,-8.825; 18 -0.7,-8.825; 19 0,-8.825; 20 0.7,-8.825; 21 1.4,-8.825; 22 2.1,-8.825; 23 2.8,-8.825; 24 3.5,-8.825; 25 4.2,-8.825 | hole 0.9: 2.2,4.45
SOT23-5 = smd 0.55 x 1.2: 1 -0.95,-1.3; 2 0,-1.3; 3 0.95,-1.3; 4 0.95,1.3; 5 -0.95,1.3
SOT23-5@1 = smd 0.55 x 1.2: 1 -0.95,-1.3; 2 0,-1.3; 3 0.95,-1.3; 4 0.95,1.3; 5 -0.95,1.3
OLGA-14 = smd 0.75 x 0.35: 1 -1.2,2.4; 2 -1.2,1.6; 3 -1.2,0.8; 4 -1.2,0; 5 -1.2,-0.8; 6 -1.2,-1.6; 7 -1.2,-2.4; 8 1.2,-2.4; 9 1.2,-1.6; 10 1.2,-0.8; 11 1.2,0; 12 1.2,0.8; 13 1.2,1.6; 14 1.2,2.4
SC70 = smd 0.4 x 0.75: 1 -0.65,-0.825; 2 0,-0.825; 3 0.65,-0.825; 4 0.65,0.825; 5 -0.65,0.825
LGA14 = smd 0.5 x 1.2: 1 2,1.1; 2 1.2,1.1; 3 0.4,1.1; 4 -0.4,1.1; 5 -1.2,1.1; 6 -2,1.1; 8 -2,-1.1; 9 -1.2,-1.1; 10 -0.4,-1.1; 11 0.4,-1.1; 12 1.2,-1.1; 13 2,-1.1 | smd 1.2 x 0.5: 7 -2.1,0; 14 2.1,0
FN-6 = smd 1.05 x 0.3: 1 -0.775,0.65; 2 -0.775,0; 3 -0.775,-0.65; 4 0.775,-0.65; 5 0.775,0; 6 0.775,0.65
UG-2864HSWEG01_0.96IN_WRAPAROUND = smd 0.35 x 2.2 bottom: 1 -10.15,-1.2; 2 -9.45,-1.2; 3 -8.75,-1.2; 4 -8.05,-1.2; 5 -7.35,-1.2; 6 -6.65,-1.2; 7 -5.95,-1.2; 8 -5.25,-1.2; 9 -4.55,-1.2; 10 -3.85,-1.2; 11 -3.15,-1.2; 12 -2.45,-1.2; 13 -1.75,-1.2; 14 -1.05,-1.2; 15 -0.35,-1.2; 16 0.35,-1.2; 17 1.05,-1.2; 18 1.75,-1.2; 19 2.45,-1.2; 20 3.15,-1.2; 21 3.85,-1.2; 22 4.55,-1.2; 23 5.25,-1.2; 24 5.95,-1.2; 25 6.65,-1.2; 26 7.35,-1.2; 27 8.05,-1.2; 28 8.75,-1.2; 29 9.45,-1.2; 30 10.15,-1.2 | hole 0.4: -8,-5.45; 8,-5.45
BGA4C40P2X2_77X77X50 = smd 0.203 x 0.203: A1 -0.203,0.203; A2 0.203,0.203; B1 -0.203,-0.203; B2 0.203,-0.203
BME280_LGA = smd 0.5 x 0.35: P$1 1.025,0.975; P$2 1.025,0.325; P$3 1.025,-0.325; P$4 1.025,-0.975; P$5 -1.025,-0.975; P$6 -1.025,-0.325; P$7 -1.025,0.325; P$8 -1.025,0.975
TQFN48_7MM = smd 0.25 x 0.75: 1 -2.75,-3.475; 2 -2.25,-3.475; 3 -1.75,-3.475; 4 -1.25,-3.475; 5 -0.75,-3.475; 6 -0.25,-3.475; 7 0.25,-3.475; 8 0.75,-3.475; 9 1.25,-3.475; 10 1.75,-3.475; 11 2.25,-3.475; 12 2.75,-3.475; 25 2.75,3.475; 26 2.25,3.475; 27 1.75,3.475; 28 1.25,3.475; 29 0.75,3.475; 30 0.25,3.475; 31 -0.25,3.475; 32 -0.75,3.475; 33 -1.25,3.475; 34 -1.75,3.475; 35 -2.25,3.475; 36 -2.75,3.475 | smd 0.75 x 0.25: 13 3.475,-2.75; 14 3.475,-2.25; 15 3.475,-1.75; 16 3.475,-1.25; 17 3.475,-0.75; 18 3.475,-0.25; 19 3.475,0.25; 20 3.475,0.75; 21 3.475,1.25; 22 3.475,1.75; 23 3.475,2.25; 24 3.475,2.75; 37 -3.475,2.75; 38 -3.475,2.25; 39 -3.475,1.75; 40 -3.475,1.25; 41 -3.475,0.75; 42 -3.475,0.25; 43 -3.475,-0.25; 44 -3.475,-0.75; 45 -3.475,-1.25; 46 -3.475,-1.75; 47 -3.475,-2.25; 48 -3.475,-2.75 | smd 4.7 x 4.7: THERMAL 0,0
DF57H-2P = smd 0.508 x 1.016: P$1 1.4,3.95; P$2 2.7,3.95 | smd 0.635 x 1.27: P$3 0.2,0.5; P$4 3.9,0.5
XTAL3215 = smd 1.1 x 1.9: P$1 1.2,0; P$2 -1.2,0
4UCONN_20329_V2 = smd 1 x 2: BASE@1 -0.75,-2; BASE@2 0.75,-2 | smd 0.4 x 1.35: D+ 0,0.775; D- -0.65,0.775; GND 1.3,0.775; ID 0.65,0.775; VBUS -1.3,0.775 | drill 0.8 pad 1.2 offset: SPRT@1 -3.3,0.9; SPRT@2 3.3,0.9 | drill 0.9 pad 2.5 square: SPRT@3 -3.6,-1.9; SPRT@4 3.6,-1.9 | hole 0.7: -1.95,0; 1.95,0

### Placement (x,y rotation side)
C1  9.49,29.87 0 bottom
C2  12.37,23.69 270 top
C3  11.32,34.78 0 top
C4  14.57,23.69 270 top
C5  26.56,28.38 270 bottom
C6  11.09,41.61 90 top
C7  14.15,41.6 90 top
C8  12.59,41.63 90 top
C9  16.53,32.66 90 bottom
C10  7.85,53.18 180 top
C11  7.82,54.78 180 top
C12  8,62.02 0 top
C14  19.62,23.89 0 top
C15  31.99,16.5 270 top
C16  26.89,21.26 90 top
C17  31.64,18.15 0 bottom
C18  17.2,45.25 0 top
C19  31.64,19.75 0 bottom
C20  8.03,60.42 0 top
C21  5.34,18.82 180 bottom
C22  28.05,41.38 90 top
C23  5.39,17.42 180 bottom
C24  10.97,25.98 0 bottom
C25  9.42,24.68 0 bottom
C26  14.98,2.7 270 top
C27  20.66,2.68 270 top
C28  3.58,38.22 90 bottom
C29  26.46,41.48 90 top
CHG  2.66,38.51 0 top
D1  8.08,39.38 270 top
D2  21.04,11.22 90 top
D3  33.21,42.97 90 top
Q1  19.23,54.22 90 top
Q2  12.83,54.28 90 top
R1  9.88,39.22 270 top
R2  4.44,38.75 270 top
R3  17.32,41.77 0 top
R4  24.83,11.16 180 top
R5  12.72,57.12 180 top
R6  17.33,43.25 180 top
R7  28.48,35.07 270 top
R8  9.16,29.49 0 top
R9  15.58,54.33 90 top
R10  33.06,41.42 0 top
R11  22.19,54.33 90 top
R12  18.72,57.15 180 top
R13  10.69,63.82 270 top
R14  31.68,16.59 180 bottom
R15  30.4,35.12 270 top
R16  7.65,28.45 90 bottom
R19  5.44,20.11 180 top
R20  5.41,18.81 180 top
R21  5.38,17.41 180 top
R23  5.41,20.2 180 bottom
SW_DOWN  34.58,27.86 270 top
SW_MODE  34.6,22.81 270 top
SW_UP  34.58,17.71 270 top
TP1  2.43,22.53 0 top
TP2  2.34,20.53 0 top
TP3  27.75,45.57 180 top
TP4  25.87,45.57 180 top
TP5  23.98,45.57 180 top
TP6  29.95,11 90 top
TP7  2.35,18.43 0 top
TP8  2.45,24.45 0 top
TP9  2.35,16.46 0 top
TP10  31.65,11.4 90 top
TP11  33.25,12.4 270 top
TP12  34.15,13.4 270 top
TP13  12.35,11.24 0 top
TP14  10.44,11.24 90 top
TP15  14.32,11.24 180 top
TP16  16.31,11.24 90 top
TP17  21.92,6.16 270 top
TP18  19.63,6.16 270 top
TP19  17.25,6.16 270 top
TP20  14.86,6.16 270 top
TP21  11.15,50 0 top
TP22  13.35,50 0 top
TP23  17.75,50 0 top
TP24  15.55,50 0 top
TP25  19.95,3.9 0 bottom
TP26  17.45,3.9 0 bottom
TP27  17.45,1.4 0 bottom
TP28  19.95,1.4 0 bottom
U1  27.41,35.47 90 bottom
U2  13.26,38.26 270 top
U3  9.75,32.01 90 top
U4  15.75,61.65 90 top
U5  7.91,57.57 180 top
U6  30.67,21.05 270 top
U8  20.76,45.35 0 top
U9  18.85,23.54 0 top
U10  18.66,2.63 0 top
U11  28.31,38.64 180 top
U$4  17.73,30.95 0 top
U$19  9.33,40.32 270 bottom
X2  13.44,25.86 180 top
X3  4.45,30.28 270 top

### Tracks (layer width: path | path; a pad name or v marks a point on that pad's centre or on a via)
1.8V  (via drill 0.4)
  Top 0.254: U4.11 15.75,63.7 v15.25,64.2 | v10.25,59.2 10.25,57.6 9.25,56.6 8.7,56.6 U5.5 8.47,56.66 C11.1 8.5,54.75 C10.1 8.5,53.05 v9.05,52.5 | R11.1 22.19,53.54 21.35,52.7 20.79,52.7 Q1.1 20.23,52.38 v19.85,52 | v15.85,52.7 15.85,53.55 R9.1 14.31,53.82 Q2.1
  Bottom 0.254: v15.25,64.2 12.95,64.2 11.05,62.3 11.05,60 v10.25,59.2 | v19.85,52 16.55,52 v15.85,52.7 15.65,52.5 v9.05,52.5
!CS1
  Top 0.254: U11.P$2 27.3,38.3 27.65,38.3 27.95,38 27.95,36 28.23,35.72 R7.1
!INT
  Top 0.254: R13.2 12.17,63.32 12.65,63.8 14.05,63.8 14.15,63.7 U4.13
!RESET  (via drill 0.4)
  Top 0.254: TP8.P$1 3.4,24.45 v3.65,24.6 | v13.05,32.6 13.05,32.2 U$4.40
  Bottom 0.254: v3.65,24.6 6.25,24.6 6.45,24.9 6.45,29.5 | 6.45,29.5 6.45,30.2 6.65,30.4 7.75,30.4 8.25,30.9 9.35,30.9 11.15,32.7 12.65,32.7 v13.05,32.6 | R16.2 6.99,28.96 6.45,29.5
+3V3  (via drill 0.4)  (1 unrouted)
  Top 0.2: TP11.P$1 33.25,13.3 32.25,14.3 32.05,14.3 31.15,15.2 31.15,16.9 31.35,17.1 31.94,17.1 C15.1
  Top 0.254: U$4.44 12.55,30.2 8.65,26.3 7.95,26.3 7.65,26.6 v7.65,26.8 | U$4.6 17.45,27.45 v17.45,26.4 | U2.5 13.96,39.21 13.45,38.7 13.45,36.9 12.95,36.4 12.95,34.7 13.22,34.43 13.38,34.43 | U$4.36 13.38,34.43 | 13.38,34.43 13.25,34.3 13.25,34.2 v13.05,34 | TP13.P$1 12.35,12.1 11.55,12.9 10.95,12.9 7.95,15.9 5.05,15.9 4.75,16.2 4.75,17.39 R21.2 | U$4.17 22.05,30.2 24.25,28 24.25,27.4 v24.75,26.9 | U8.1 19.79,46.2 16.55,46.2 C18.1 16.4,45.4 15.65,45.4 14.95,44.7 14.95,41.2 14.85,41.1 C7.1 | C29.1 27.95,40.97 C22.1 30.08,40.87 30.45,40.5 30.45,39.8 | U11.P$6 29.37,39 30.25,39 30.45,39.2 30.45,39.8 | U11.P$8 29.9,37.1 v30.85,37.1 31.05,37.1 31.45,36.7 31.45,35.1 31.15,34.8 | v32.85,38.7 31.75,39.8 30.45,39.8 | 31.15,34.8 30.95,34.6 30.53,34.6 R15.2 30.35,34.42 R7.2 | C16.A 26.89,23.04 28.65,24.8 28.65,26.1 v29.55,27 31.25,27 31.55,26.7 31.55,24.8 30.65,23.9 30.65,23.17 U6.7 31.67,23.15 U6.6 32.7,23.05 32.95,22.8 32.95,22.2 33.45,21.7 33.95,21.7 34.15,21.5 34.15,19.7 33.5,19.05 U6.1 31.99,18.83 C15.1 | v31.65,34.9 31.35,34.6 31.15,34.8 | R20.2 4.76,20.09 R19.2 | 4.76,18.74 2.66,18.74 TP7.P$1 | R12.1 19.23,57.92 v19.15,58 | R5.1 v13.23,58.22 13.11,58.1 12.45,58.1 11.05,58.2 10.85,58 10.85,52.6 12.05,51 12.95,51 13.35,50.6 TP22.1 | v6.45,59.4 6.45,60.5 6.55,60.6 7.2,60.6 | 7.2,60.6 C20.1 7.26,60.3 7.26,59.4 | 7.2,60.6 7.2,61.86 C12.1 7.65,62.32 7.65,63.3 8.68,64.33 R13.1 | U5.3 7.26,59.4 | U5.1 8.56,59.09 8.35,59.3 7.36,59.3 7.26,59.4 | U4.10 U4.9 17.35,62.1 17.95,61.5 18.95,61.5 19.35,61.1 19.35,60.4 v19.45,60.3
  Top 0.406: C8.1 12.61,41.1 C7.1 14.15,40.3 14.56,39.89 U2.5 | R20.2 4.76,18.74 R21.2 | R19.2 4.79,21.24 v5.45,21.9 | v28.55,34.5 28.35,34.3 R7.2
  Bottom 0.254: C23.2 6.33,17.42 | U9.6 12.25,22.39 12.25,20.9 12.45,20.7 14.05,20.7 14.35,21 14.35,22.29 U9.9 14.3,20.95 14.65,20.6 15.45,20.6 15.65,20.8 15.65,22.29 U9.11 | U1.3 26.56,30.59 C5.1 25.95,28.9 25.85,28.8 25.85,28.4 25.55,28.1 25.55,27.1 25.35,26.9 v24.75,26.9 | v5.45,21.9 5.45,22.9 7.05,24.5 7.05,27 | 7.05,27 7.05,27.34 R16.1 | 7.05,27 7.45,27 v7.65,26.8 8.05,27.2 8.45,27.2 9.65,28.4 11.85,28.4 14.15,30.7 14.15,33.1 13.05,33.9 v13.05,34 | v17.45,26.4 17.44,25.89 16.94,25.89 | v30.85,37.1 31.25,36.7 32.45,36.7 32.85,37.1 v32.85,38.7 | v29.55,27 29.55,27.6 29.15,28 29.15,31.8 30.65,33.3 30.65,34.3 30.95,34.6 31.45,34.6 31.55,34.7 v31.65,34.9 | v6.45,59.4 7.65,58.2 11.65,58.3 13.15,58.3 v13.23,58.22 13.63,58.22 13.75,58 v19.15,58 19.45,58.3 v19.45,60.3
  Bottom 0.4: v5.45,21.9 5.85,21.9
  Bottom 0.406: 5.97,18.78 C21.2 | C21.2 5.92,17.47 C23.2 | 6.01,18.92 C21.2 | 12.25,20.9 11.46,20.11 6.15,20.11 R23.2 | U9.11 15.7,24.15 16.95,25.1 16.94,25.89 16.85,31.93 C9.1 16.71,31.97 U1.14 18.61,32 20.15,32 20.55,32.4 20.55,37.8 21.45,38.7 25.65,38.7 26.75,37.6 27.65,37.6 28.75,36.5 28.75,35.3 v28.55,34.5 26.51,32.56 U1.3 | R23.2 6.06,18.97 C21.2 | 5.85,21.9 6.15,21.6 6.15,20.29 R23.2
A1  (via drill 0.4)
  Top 0.254: U$4.7 17.98,27.07 18.35,26.5 18.35,26 19.35,25 21.65,25 23.15,23.5 23.15,19.8 22.15,18.8 21.55,18.3 v20.75,17.7 | v14.15,12.9 14.15,11.41 TP15.P$1
  Bottom 0.254: v14.15,12.9 13.55,13.5 11.35,13.5 10.45,14.4 10.45,16.2 11.45,17.2 20.35,17.2 20.75,17.6 v20.75,17.7
AREF
  Top 0.254: U$4.4 16.48,26.27 16.75,26 16.75,25.5 16.95,25.3 17.7,25.3 C14.1
BLE_SWCLK  (via drill 0.4)
  Top 0.254: v27.35,43.9 TP3.P$1
  Bottom 0.254: U1.36 27.21,43.26 v27.35,43.9
CONNECTED  (via drill 0.4)
  Top 0.254: v31.35,42.1 32.03,41.42 R10.1
  Bottom 0.254: U1.39 29.35,40.34 29.35,41.7 29.55,41.9 30.95,41.9 31.15,42.1 v31.35,42.1
CS_3.3V  (via drill 0.4)
  Top 0.254: R19.1 16.56,20.11 v16.85,20.4
  Bottom 0.254: v16.85,20.4 17.1,20.65 U9.13
D4_SWDIO/RST  (via drill 0.4)
  Top 0.254: v23.55,25.6 23.55,25.86 U$4.13 | TP4.P$1 25.87,43.98 v26.05,43.8
  Bottom 0.254: v23.55,25.6 24.05,25.1 27.75,25.1 27.75,32.1 29.55,33.9 29.55,37 27.95,38.6 26.65,38.6 26.51,38.74 U1.35 26.51,43.34 v26.05,43.8
D7_BLE_IRQ  (via drill 0.5)
  Top 0.254: U$4.30 17.98,37.53 18.85,38.4 20.75,38.4 v21.85,37.3
  Bottom 0.254: U1.8 23.01,31.84 22.65,32.2 22.05,32.2 21.35,32.9 21.35,36.8 v21.85,37.3
D8_BLE_CS  (via drill 0.4)
  Top 0.254: U$4.11 19.98,26.63 v19.45,26.1
  Bottom 0.254: v19.45,26.1 22.25,26.1 23.75,27.6 23.75,30.6 U1.7
D9  (via drill 0.4, 0.5)
  Top 0.254: R6.1 17.84,43.09 | R3.2 17.84,43.09 | U$4.12 20.48,25.87 20.75,25.6 22.15,25.6 23.95,23.8 | 23.95,23.8 23.95,19.5 21.25,16.8 11.75,16.8 10.65,15.7 10.65,14.5 11.25,13.9 14.95,13.9 15.95,12.9 15.95,11.6 TP16.P$1 | 17.84,43.09 18.55,43.8 19.15,43.8 v19.35,43.6 | v20.55,42.1 20.55,39.9 22.05,38.4 22.95,38.4 v23.75,37.6 | v24.55,33.8 24.85,33.5 24.85,30.8 26.25,29.4 26.25,28.5 25.55,27.8 25.55,26.2 23.95,24.6 23.95,23.8
  Bottom 0.254: v19.35,43.6 19.65,43.6 20.35,42.9 20.35,42.3 v20.55,42.1 | v23.75,37.6 23.75,34.6 v24.55,33.8
D+  (via drill 0.4)
  Top 0.254: X3.D+ 6.83,30.28 7.35,30.8 7.35,31.5 7.75,31.9 8.55,31.9 v8.65,32 | v13.75,35.3 15.65,35.3 15.98,34.97 U$4.34
  Bottom 0.254: v8.65,32 10.15,33.6 10.15,34.2 11.25,35.3 v13.75,35.3
D-  (via drill 0.4)
  Top 0.254: X3.D- 5.98,30.93 v6.55,31.5 | v14.55,36.3 15.25,36.3 16.48,35.17 U$4.33
  Bottom 0.254: v6.55,31.5 6.55,31.9 7.15,32.5 7.95,32.5 9.55,34.1 9.55,34.7 10.65,35.8 12.85,35.8 13.45,36.3 v14.55,36.3
DC/SA0_3.3V  (via drill 0.4)
  Top 0.254: v15.55,18.3 12.05,18.3 11.05,17.3 6.14,17.3 R21.1
  Bottom 0.254: U9.15 18.55,22.29 18.55,20.7 19.15,20.1 19.15,18.3 v15.55,18.3
EN
  Top 0.254: R1.2 9.88,38.57 11.05,37.4 11.87,37.4 U2.3
  Top 0.406: 11.95,37.3 U2.3
FCTRYRST  (via drill 0.4)
  Top 0.254: TP5.P$1 24.25,45.31 v24.25,44.1
  Bottom 0.254: v24.25,44.1 24.35,44.1 25.81,42.64 U1.34
GND  (via drill 0.4)  (1 unrouted)
  Top 0.254: U$4.5 16.98,30.2 17.31,30.54 | 17.31,30.54 U$4.THERMAL | U$4.18 v17.98,30.7 U$4.THERMAL | 17.31,30.54 16.65,31.2 U$4.42 13.15,31.2 12.34,32.01 U3.2 | U$4.35 15.48,33.2 | 15.48,33.2 U$4.THERMAL | v13.55,24.2 13.55,23.8 13.4,23.65 | 13.4,23.65 13.05,23.3 12.49,23.3 C2.2 12.25,23 v8.05,23 | C4.2 14.49,23.1 13.6,23.1 13.4,23.3 13.4,23.65 | U11.P$7 29.35,38.3 v30.75,38.3 | C29.2 27.95,41.98 C22.2 28.05,43 28.25,43.2 28.25,44.4 29.35,45.5 31.25,45.5 v32.55,44.2 32.46,44.11 D3.C | v18.15,44.5 18.15,44.95 C18.2 | 15.48,33.2 v16.78,33.2 | U5.2 7.91,57.56 7.55,57.2 7.55,57.03 U5.4 | U4.12 14.95,61.9 15.05,61.8 | 15.05,61.8 15.35,61.8 15.75,61.4 | 15.75,61.4 U4.4 15.75,61.4 | 15.05,61.8 10.85,61.8 10.25,61.2 9.47,61.2 | SW_MODE.P$1 35.51,24.53 v35.68,24.7
  Bottom 0.2: U1.2 30.92,30.64 v30.98,30.7
  Bottom 0.254: U9.8 13.6,24.15 v13.55,24.2 14.05,24.2 14.25,24.4 14.65,24.4 14.95,24.1 14.95,22.39 U9.10 | v8.05,23 8.05,22.7 8.41,22.34 U9.1 | U9.12 16.45,22.39 16.45,23.8 16.85,24.2 v17.35,24.2 | v17.98,30.7 18.01,30.7 U1.13 | v30.75,38.3 31.41,38.96 U1.42 32.55,41.44 v32.55,44.2 | U1.2 U1.1 | U1.25 18.58,41.97 18.35,42.2 18.35,44.3 v18.15,44.5 | U1.16 16.74,33.37 C9.2
  other vias: 20.25,19 23.15,17.3 12.38,31.6 13.58,43.9 15.78,44.1 24.18,42.8 33.38,20.6 32.58,24.5 35.28,19.4 33.18,15 35.08,14.5 19.58,12.8 24.48,12.8 4.98,14.8 8.68,28.5 26.78,26 35.48,29.4 27.88,17.2 25.18,37.5 31.68,33.7
  pour Bottom (isolate 0.254): 0.15,8.1 37.35,8.1 37.35,47.7 0.15,47.7
  pour Top (isolate 0.254): 0.35,8.3 37.15,8.3 37.15,47.5 0.35,47.5
  pour Bottom (isolate 0.254): 4.95,65.3 23.25,65.3 23.25,47.9 4.95,47.9
  pour Top (isolate 0.254): 5.15,65.1 22.95,65.1 22.95,48.1 5.15,48.1
GND1  (via drill 0.4, 0.5)
  Top 0.254: U10.A1 18.42,2.83 v18.05,3.2 | C26.2 15.7,2.05 v15.75,2
  Bottom 0.254: v18.05,3.2 17.45,3.8 TP26.P$1 17.45,4.2 18.65,5.4 18.88,5.4 TP18.1 | v15.75,2 15.75,4.2 15.95,4.4
  other vias: 22.15,1.8 21.75,4.4
  pour Top (isolate 0.254): 12.95,7.9 12.95,-0.8 24.25,-0.8 24.25,7.9
  pour Bottom (isolate 0.254): 13.35,7.5 13.35,0 arc90 13.75,-0.4 23.65,-0.4 arc90 23.75,-0.3 23.75,7.5
INT1  (via drill 0.4)
  Top 0.2: U$4.26 19.98,35.03 20.45,35.5 25.55,35.5 26.25,34.8 26.25,32.7 27.15,31.8 29.65,31.8 30.15,31.3 30.15,29.4 v31.05,28.5
  Top 0.254: U6.8 29.57,23.12 29.65,23.2 29.65,25 30.65,26 v30.65,26.1
  Bottom 0.254: v31.05,28.5 31.05,26.5 v30.65,26.1
LV_SCL
  Top 0.254: Q2.2 14.22,54.83 R9.2 14.85,55.57 14.85,58.7 14.15,59.4 U4.2
LV_SDA
  Top 0.254: U4.3 14.95,59.7 15.55,59.1 19.85,59.1 20.55,58.4 20.55,55.49 | 20.55,55.49 Q1.2 | 20.55,55.49 21.54,55.49 R11.2
MISO  (via drill 0.4)
  Top 0.254: U$4.21 21.85,32.2 v22.45,33.1
  Bottom 0.254: U1.5 25.15,30.69 25.15,31.8 24.95,32 23.65,32 22.55,33.1 v22.45,33.1
MODE  (via drill 0.4)
  Top 0.254: v27.55,11.1 25.4,11.1 R4.1
  Bottom 0.2: 34.35,21.5 34.35,18.2 33.45,17.3 33.45,16 34.05,15.4 34.05,14.2 34.35,13.9
  Bottom 0.254: U1.38 28.55,40.24 28.55,39 30.05,37.5 30.05,33.4 28.45,31.8 28.45,24.9 29.95,23.4 29.95,22 30.25,21.7 34.15,21.7 34.35,21.5 | v27.55,11.1 27.75,11.3 31.75,11.3 34.35,13.9
MOSI  (via drill 0.4)
  Top 0.254: v24.95,28.7 24.25,29.4 24.25,30.8 23.85,31.2 U$4.19
  Bottom 0.254: U1.6 24.45,30.6 24.45,29.2 v24.95,28.7
N$1
  Top 0.406: CHG.C R2.1
N$3
  Top 0.254: R2.2 4.44,37.51 4.95,37 6.05,37 9.55,33.6 9.55,31.4 9.85,31 10.99,31 U3.1
N$4
  Top 0.254: R8.1 8.65,30.86 U3.5
N$5
  Top 0.254: C2.1 12.24,24.32 X2.P$1 12.05,26.05 12.05,26.4 13.13,27.48 U$4.1
N$6
  Top 0.254: R4.2 21.85,11.16 D2.A
N$7
  Top 0.254: U$4.2 15.48,26.69 X2.P$2 14.57,25.78 C4.1
N$8
  Top 0.254: R10.2 33.96,41.81 D3.A
N$11
  Bottom 0.254: U9.26 26.2,19.95 29.55,16.6 31.02,16.6 R14.1
N$12
  Bottom 0.254: C25.2 8.84,24.31 9.35,23.8 9.35,22.39 U9.2
N$13
  Bottom 0.254: C25.1 10,23.75 10.15,23.6 10.15,22.39 U9.3
N$14
  Bottom 0.254: C24.2 10.39,25.76 10.85,25.3 10.85,22.39 U9.4
N$15
  Bottom 0.254: U9.5 11.5,25.93 C24.1
N$16
  Bottom 0.254: U9.28 27.6,20.85 28.75,19.7 31.02,19.7 C19.2
N$17
  Bottom 0.254: U9.27 26.9,20.35 29.05,18.2 31.01,18.2 C17.2
NAV_DOWN  (via drill 0.4)
  Top 0.2: U$4.28 18.98,35.33 20.45,36.8 21.05,36.8 21.65,36.4 25.95,36.4 27.05,35.3 27.05,33.4 27.75,32.7 32.55,32.7 v33.15,32.1 | v35.25,28.2 35.65,26.36 SW_DOWN.P$2
  Bottom 0.2: v33.15,32.1 33.15,30 v35.25,28.2
NAV_SEL  (via drill 0.4)
  Top 0.2: U$4.27 19.48,35.13 20.45,36.1 21.15,36.1 21.45,35.9 25.75,35.9 26.65,35 26.65,33 27.35,32.3 31.85,32.3 32.55,31.6 32.55,29.3 32.75,29.1 v32.85,29.1 | v35.65,23 35.65,21.28 SW_MODE.P$2
  Bottom 0.2: v32.85,29.1 34.75,27.2 34.75,23.7 v35.65,23
NAV_UP  (via drill 0.4)
  Top 0.2: U$4.25 20.48,34.83 20.75,35.1 25.35,35.1 25.85,34.6 25.85,32.3 26.95,31.2 28.75,31.2 29.25,30.7 29.25,29.1 30.75,27.6 31.85,27.6 v33.65,25.8 | v35.55,17.1 35.55,16.11 SW_UP.P$2
  Bottom 0.2: v33.65,25.8 33.65,23.8 36.05,21.4 36.05,17.6 v35.55,17.1
RST_3.3V  (via drill 0.4)
  Top 0.2: 21.2,33.95 21.2,34.45 21.35,34.6 24.95,34.6 25.35,34.2 25.35,31.7 26.95,30.1 26.95,28.4 26.05,27.5 26.05,25.1 24.75,23.8 24.75,18.9 24.35,18.6 24.35,17.7 24.95,16.9 26.15,16.8 26.95,16 26.95,13.8 26.75,13.6 18.35,13.6 v17.35,12.6 | v8.75,18.6 8.75,19.3 8.65,19.4
  Top 0.254: R20.1 6.15,18.9 6.65,18.9 7.15,19.4 8.65,19.4 v18.05,19.4 | 21.2,33.95 U$4.24
  Bottom 0.2: v17.35,12.6 16.15,12.6 14.95,11.4 12.15,11.4 9.75,13.8 9.75,17.6 v8.75,18.6
  Bottom 0.254: v18.05,19.4 18.25,19.6 18.25,20 17.8,20.45 U9.14
SCK  (via drill 0.4)
  Top 0.254: U$4.20 22.65,31.7 v23.85,32.9
  Bottom 0.254: U1.4 25.85,30.69 25.85,32.2 25.25,32.8 23.95,32.8 v23.85,32.9
SCL  (via drill 0.4, 0.5)  (1 unrouted)
  Top 0.2: TP10.P$1 31.65,12.7 31.95,13 31.95,13.8 30.15,15.6
  Top 0.254: v20.35,20.5 18.85,20.5 17.85,21.5 7.65,21.5 v7.05,22.1 | v16.05,38.2 16.35,38.2 16.98,37.57 U$4.32 | U8.4 v21.55,43.8 | v23.05,41.9 23.05,39.8 23.23,39.62 U11.P$4 | v28.55,15.1 29.65,15.1 30.15,15.6 30.65,16.1 30.65,18.93 U6.14 | TP24.1 15.55,51 14.65,51.9 12.55,51.9 12.15,52.3 12.15,53.86 Q2.3 11.73,56.63 R5.2
  Bottom 0.254: U9.18 20.6,20.75 | 20.6,20.75 v20.35,20.5 | v7.05,22.1 7.05,23.7 7.55,24.2 7.55,25.3 9.75,27.5 12.25,27.5 14.75,30 14.75,35.1 15.65,36 15.65,37.8 | 15.65,37.8 v16.05,38.2 | 15.65,37.8 15.65,39.9 17.05,41.3 17.05,43.5 16.95,43.6 16.95,45.1 17.35,45.5 20.05,45.5 20.55,45 20.55,44.6 21.35,43.8 v21.55,43.8 | 21.25,43.8 v21.55,43.8 | v23.05,41.9 21.55,43.4 v21.55,43.8 | 20.6,20.75 20.6,20.05 21.85,18.8 23.05,18.9 24.85,17 25.95,17 27.25,15.7 27.95,15.7 v28.55,15.1
SDA  (via drill 0.4)  (1 unrouted)
  Top 0.2: TP6.P$1 29.45,11 27.75,12.7 27.75,16.2
  Top 0.254: v15.85,25.8 15.85,23.2 16.85,22.3 20.15,22.3 v21.75,20.7 | U$4.31 17.48,38.87 17.4,38.95 | 17.4,38.95 v16.65,39.7 | U8.6 22.35,46 22.75,45.6 22.75,43.5 22.15,42.9 22.15,42.7 | 17.4,38.95 17.4,39.05 19.35,41 19.35,42.3 20.25,43.2 20.85,43.2 21.35,42.7 22.15,42.7 | U11.P$3 22.48,38.97 22.15,39.3 22.15,42.7 | U6.13 29.57,17.62 28.35,16.2 27.75,16.2 27.55,16.2 v25.85,18.2 | R12.2 18.13,57.06 Q1.3 18.13,52.08 17.55,51.5 17.55,50.2 TP23.1
  Bottom 0.254: U9.19 U9.20 22,20.95 v21.75,20.7 22.85,19.6 23.85,19.6 25.25,18.2 v25.85,18.2 | v15.85,25.8 15.35,26.1 15.35,34.8 16.45,35.9 16.45,36.8 16.95,37.3 16.95,38.7 16.65,39 v16.65,39.7
SDO/ADR1
  Top 0.254: 29.98,35.77 R15.1 29.88,35.77 29.15,36.5 28.85,36.5 28.55,36.8 28.55,39.4 28.75,39.6 29.32,39.6 U11.P$5
SWCLK
  Top 0.254: U$4.45 12.75,29.7 7.25,24.2 4.55,24.2 2.88,22.53 TP1.P$1
SWDIO
  Top 0.254: U$4.46 12.95,29.2 7.35,23.6 5.05,23.6 3.55,22.1 3.55,21.3 2.78,20.53 TP2.P$1
T_ON  (via drill 0.4, 0.5)
  Top 0.2: U10.B2 18.96,2.29 v19.25,2.1
  Top 0.254: v15.05,0.9 18.05,0.9 v19.25,2.1
  Bottom 0.254: TP20.1 14.86,1.09 v15.05,0.9 | TP28.P$1 v19.25,2.1
TAO  (via drill 0.5)
  Top 0.2: U10.B1 18.27,2.42 v18.05,2.1
  Top 0.254: v18.05,2.1 17.45,1.5 17.05,1.5 16.75,1.8 16.75,3.3 16.7,3.35 | C26.1 16.7,3.35 | 16.7,3.35 17.05,3.7 17.05,5.96 TP19.1
  Bottom 0.254: TP27.P$1 17.45,1.5 v18.05,2.1
V3  (via drill 0.5)
  Top 0.254: U10.A2 18.88,2.83 v19.15,3.2 19.21,3.26 C27.1 22.11,3.26 22.65,3.5 22.65,5.73 TP17.1 22.26,5.82
  Bottom 0.254: 19.05,3.4 v19.15,3.2 19.85,3.9 TP25.P$1
VBAT  (via drill 0.4)
  Top 0.254: C3.1 10.82,36.03 10.35,36.5 v10.35,36.8 | v15.75,42.5 16.09,42.5 R3.1
  Top 0.406: U3.3 11.05,33.6 10.75,33.9 10.75,34.71 C3.1 9.57,34.78 7.95,36.4 7.95,37.4 D1.A 7.95,37.4 7.15,37.4 6.75,37.8 v6.75,38.4
  Bottom 0.254: v10.35,36.8 10.35,39 11.25,39.9 14.65,39.9 15.65,40.9 15.65,42.4 v15.75,42.5
  Bottom 0.406: C28.2 5.33,38.87 U$19.P$1 6.23,38.92 v6.75,38.4
VBUS  (via drill 0.4)
  Top 0.254: CHG.A 2.66,36.69 3,36.35 5.7,36.35 8.25,33.8 8.25,33.15 U3.4
  Top 0.4: v7.25,33.5 7.38,33.38
  Top 0.406: U3.4 7.79,32.96 v7.25,33.5 6.25,32.5 5.65,32.5 5.22,32.07 X3.VBUS | D1.C 10.02,41.23 | R1.1 9.88,41.09 10.02,41.23 | U2.1 11.14,39.21 10.65,39.7 9.91,39.7 R1.1 | R1.1 7.12,39.73 v6.35,40.5 | 10.02,41.23 10.96,41.23 C6.1
  Bottom 0.406: v6.35,40.5 6.45,40.5 7.95,39 7.95,37.3 7.25,36.6 v7.25,33.5
VDDCORE  (via drill 0.4)
  Top 0.254: v10.95,30.1 11.55,30.1 12.15,30.7 U$4.43
  Bottom 0.254: C1.1 10.72,29.87 v10.95,30.1

### Text on the board
tPlace: Reset | Swdio | Swclk | CHG | Reset | Swclk | Swdio | 3V3 | Gnd